# Altium project obc_ver2.PrjPcb (part 1 of 3)
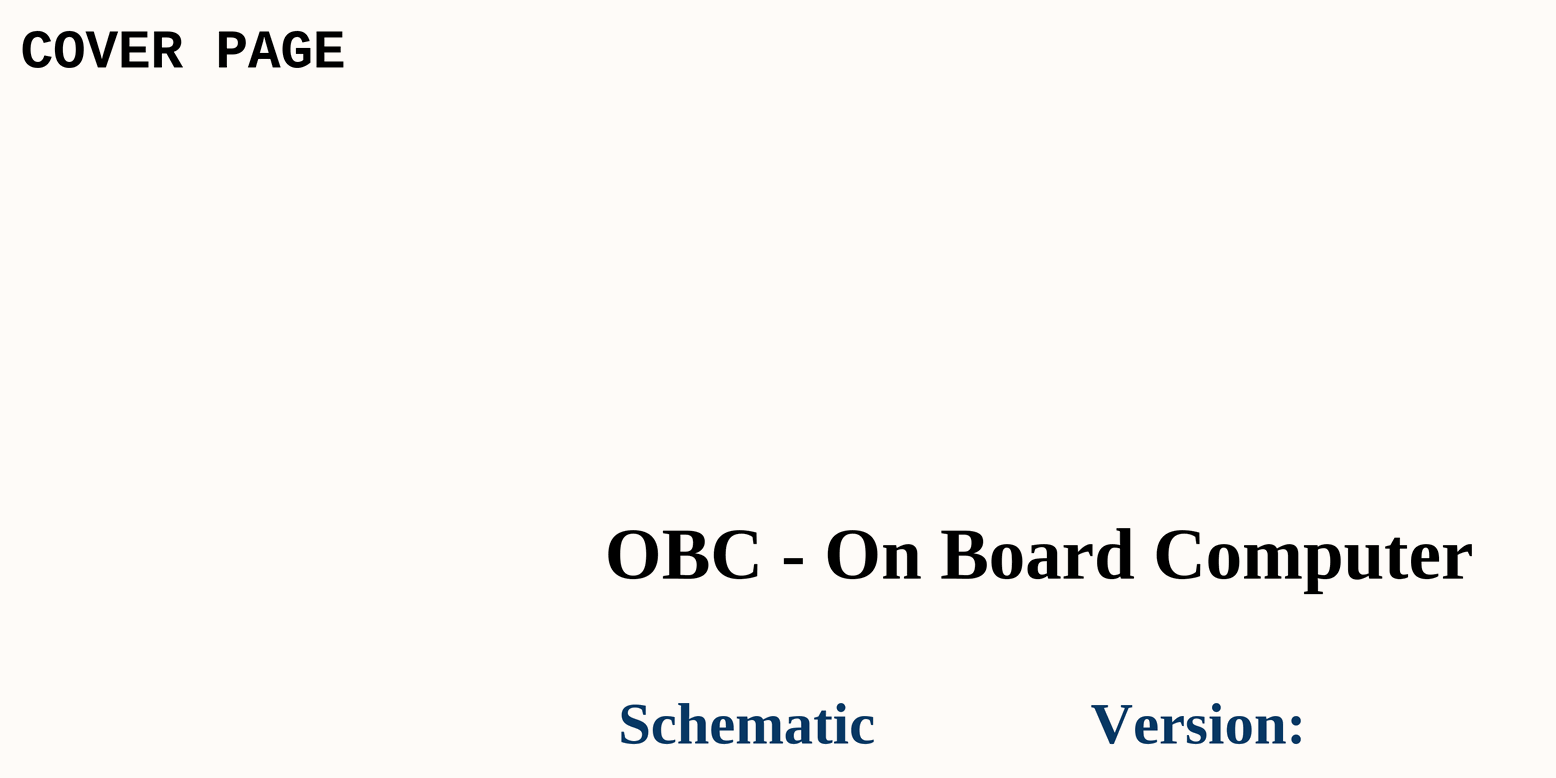
[diagram p0: obc-v2_COVER-PAGE.SchDoc]
23 sheets, 430 parts. Net scope: flat (ports and power ports of the same name join across sheets).
Board file: obc_ver2_pcb.PcbDoc
Sheets:
  obc-v2_COVER-PAGE.SchDoc
  obc-v2_INDEX.SchDoc
  obc-v2_TREE.SchDoc
  obc-v2_POWER.SchDoc
  obc-v2_OUT-eMMC.SchDoc
  obc-v2_TMP-eMMC.SchDoc
  obc-v2_RTC-WDOG.SchDoc
  obc-v2_FRAM-FLASH.SchDoc
  obc-v2_BOARD-CONNECT.SchDoc
  obc-v2_GADGET-CONNECT.SchDoc
  obc-v2_DEBUG.SchDoc
  obc-v2_USB-HUB.SchDoc
  obc-v2_EXP-I2C-IRQ.SchDoc
  obc-v2_EXP-CAN-RS422.SchDoc
  obc-v2_CM4-M2.SchDoc
  obc-v2_CM4-PinOut.SchDoc
  obc-v2_CM4-SPI-UART.SchDoc
  obc-v2_CM4-IRQ-CTRL.SchDoc
  obc-v2_CM4-FUNCTION.SchDoc
  obc-v2_CM4-CSI.SchDoc
  obc-v2_CM4-POWER.SchDoc
  obc-v2_MCU-POWER.SchDoc
  obc-v2_MCU-PinOut.SchDoc

## Sheet obc-v2_COVER-PAGE.SchDoc
size 420 x 297 mm; SheetNumber: 1; SheetTotal: 23

### Notes on the sheet
- COVER PAGE
- OBC - On Board Computer
- Schematic
- Version:
- Project:
- Sub-system:
- Design by:
- Sheet title:
- Sheet
- A3
- of
- Checked by:
- Approved by:
- Revision:
- Document No:
- Size:
- Date:

## Sheet obc-v2_INDEX.SchDoc
size 420 x 297 mm; SheetNumber: 2; SheetTotal: 23
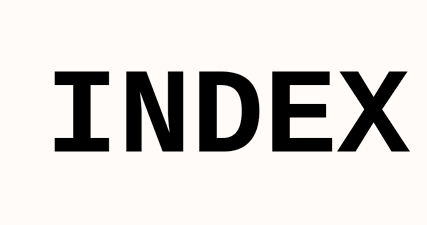
[diagram p1: obc-v2_INDEX.SchDoc]

### Notes on the sheet
- INDEX
- Project:
- Sub-system:
- Design by:
- Sheet title:
- Sheet
- A3
- of
- Checked by:
- Approved by:
- Revision:
- Document No:
- Size:
- Date:

## Sheet obc-v2_TREE.SchDoc
size 420 x 297 mm; SheetNumber: 3; SheetTotal: 23
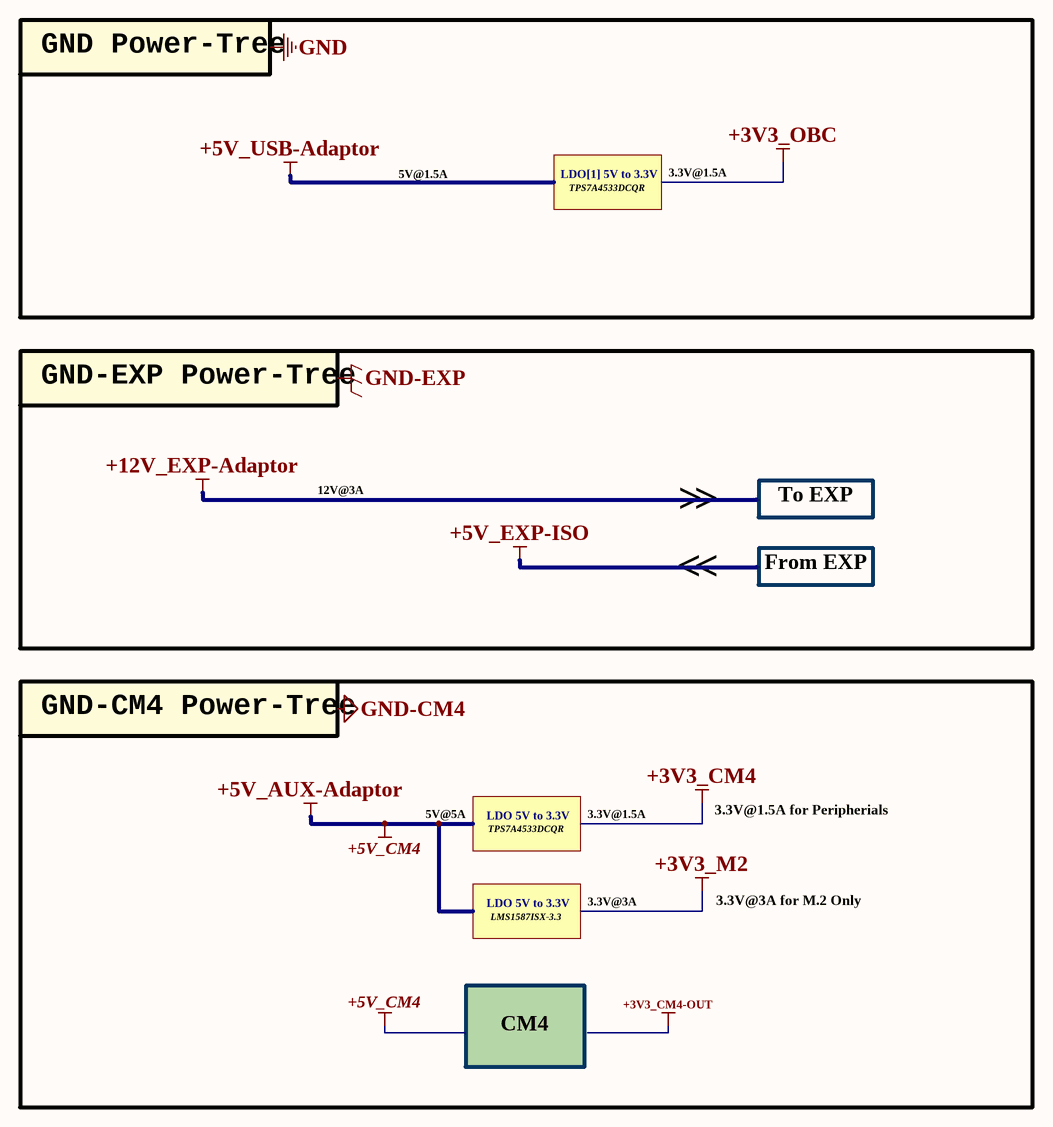
[diagram p2: obc-v2_TREE.SchDoc]

### Notes on the sheet
- GND Power-Tree
- 5V@1.5A
- LDO[1] 5V to 3.3V
- TPS7A4533DCQR
- 3.3V@1.5A
- GND-EXP Power-Tree
- 12V@3A
- >
- To EXP
- <
- From EXP
- GND-CM4 Power-Tree
- 5V@5A
- 3.3V@1.5A for Peripherials
- LDO 5V to 3.3V
- LMS1587ISX-3.3
- 3.3V@3A
- 3.3V@3A for M.2 Only
- CM4
- Labels drawn without touching a wire or pin: GND, GND-CM4, GND-EXP
- Project:
- Sub-system:
- Design by:
- Sheet title:
- Sheet
- A3
- of
- Checked by:
- Approved by:
- Revision:
- Document No:
- Size:
- Date:

## Sheet obc-v2_POWER.SchDoc
size 420 x 297 mm; SheetNumber: 4; SheetTotal: 23
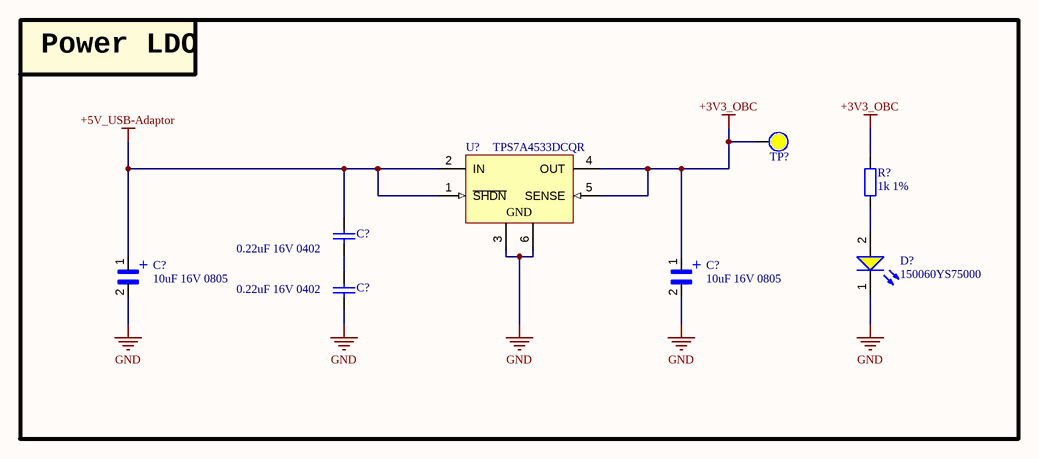
[diagram p3: obc-v2_POWER.SchDoc]

### Parts
(Parts that share a designator on the sheet are numbered #1, #2 ... from top to bottom, then left to right.)
C?#1  0.22uF 16V 0402  [tu 0402]
C?#2  10uF 16V 0805  [CAPC2012X140N]
C?#3  10uF 16V 0805  [CAPC2012X140N]
C?#4  0.22uF 16V 0402  [tu 0402]
D?#1  150060YS75000  [WL-SMCW_0603_150060xx75000]
R?#1  1k 1%  [tro smd 0603]
TP?#1  (no value)  [Test Point 1 Side]  (no BOM)
U?#1  TPS7A4533DCQR  [DCQ0006A_M]

### Blocks framed on the sheet
Power LDO: C?#1-C?#4 D?#1 R?#1 TP?#1 U?#1

### Nets
+3V3_OBC: C?#3.1 R?#1.2 TP?#1.0 U?#1.4(OUT) U?#1.5(SENSE)
+5V_USB-Adaptor: C?#1.1 C?#2.1 U?#1.1(~{SHDN}) U?#1.2(IN)
GND: C?#2.2 C?#3.2 C?#4.2 D?#1.1(K) U?#1.3(GND) U?#1.6(GND)
NetC?#1_2: C?#1.2 C?#4.1
NetD?#1_2: D?#1.2(A) R?#1.1

### Notes on the sheet
- Project:
- Sub-system:
- Design by:
- Sheet title:
- Sheet
- A3
- of
- Checked by:
- Approved by:
- Revision:
- Document No:
- Size:
- Date:
- (in symbol TACR686M003RTA) +

### Library data of the parts
C?#1 C?#4 = Tu 0402 33nF 10V: 0.22 µF ±10% 16V Ceramic Capacitor X7R 0402 (1005 Metric): GCM155R71C224KE02D; Chung_Loai: Dán; Don_Vi: Con; So_Chan: 2; Ten_Linh_Kien: Tụ 0402 33nF X7R 10V GRM155R71A333KA01D; Ma_Hang: MH007853; Kieu_Chan: *
C?#2 C?#3 = TACR686M003RTA: 10 µF Molded Tantalum Capacitors 16 V 0805 (2012 Metric) 8Ohm @ 100kHz: TP8R106M016C; MF: AVX; Availability: Unavailable; SnapEDA_Link: https://www.snapeda.com/parts/TACR686M003RTA/AVX/view-part/1745975/?ref=snap; MP: TACR686M003RTA; Value: *; Price: None; Package: 0805 AVX
D?#1 = CMP-1426-00005-2: LED YELLOW CLEAR 0603 SMD; NexarPartId: 29687085; Wavelength: 590nm; Luminous Intensity: 120mcd; Peak Wavelength: 595nm; Forward Current: 100mA; Power Dissipation: 72mW; Forward Voltage: 2V; Test Current: 20mA; Reverse Voltage: 5V; Lens Style: Clear, Rectangular; Max Junction Temperature (Tj): 95°C; Viewing Angle: 140°; Case Code (Imperial): 0603; Height: 700µm; REACH SVHC: Unknown; Dominant Wavelength: 590nm; Min Operating Temperature: -40°C; Color: Yellow; Width: 800µm; Mount: Surface Mount; Packaging: Tape and Reel; Max Operating Temperature: 85°C; RoHS: Compliant; Max Reverse Voltage (DC): 5V; Case Code (Metric): 1608; Length: 1.6mm; Case/Package: 0603
R?#1 = Tro 0603 1% 10k: RES SMD 2.2K OHM 1% 1/10W 0603, P/N: ERJ-3EKF2201V; Chung_Loai: Dán; Don_Vi: Con; So_Chan: 2; Ten_Linh_Kien: Trở 0603 1% 10k; Ma_Hang: MH006333; Kieu_Chan: *
TP?#1 = Test Point: Solder: NF
U?#1 = CMP-0395-00360-2: Single Output Fast Transient Response LDO, 1.5 A, Fixed 3.3 V Output, 2.1 to 20 V Input, 6-pin SOT-223 (DCQ), -40 to 125 degC, Green (RoHS & no Sb/Br); Manufacturer: Texas Instruments; Vout Adj(Max)(V): 3.3; Vin(Max)(V): 20; Accuracy(%): 1; SubFamily: Single Channel LDO; Vin(Min)(V): 2.1; Iout(Max)(A): 1.5; Vdo(Typ)(mV): 300; Eco-Plan: Green (RoHS & no Sb/Br); Mounting Technology: Surface Mount; PackageDescription: 6-Pin Plastic Small Outline, Body 3.5 x 6.5 mm, Pitch 1.27 mm; ComponentLink2URL: http://www.ti.com/general/docs/lit/getliterature.tsp?genericPartNumber=TPS7A4533&fileType=pdf; PackageReference: DCQ0006A; ComponentLink3Description: Package Specification; ComponentLink2Description: Datasheet; Fixed Output Options(V): 3.3; Iq(Typ)(mA): 1; ComponentLink1URL: http://www.ti.com/; PartNumber: TPS7A4533DCQR; ComponentLink1Description: Manufacturer URL; PackageVersion: 4202109/D; Vout Adj(Min)(V): 3.3; DatasheetVersion: SLVS720D; ComponentLink3URL: http://www.ti.com/litv/pdf/mpds098c

## Sheet obc-v2_OUT-eMMC.SchDoc
size 420 x 297 mm; SheetNumber: 5; SheetTotal: 23
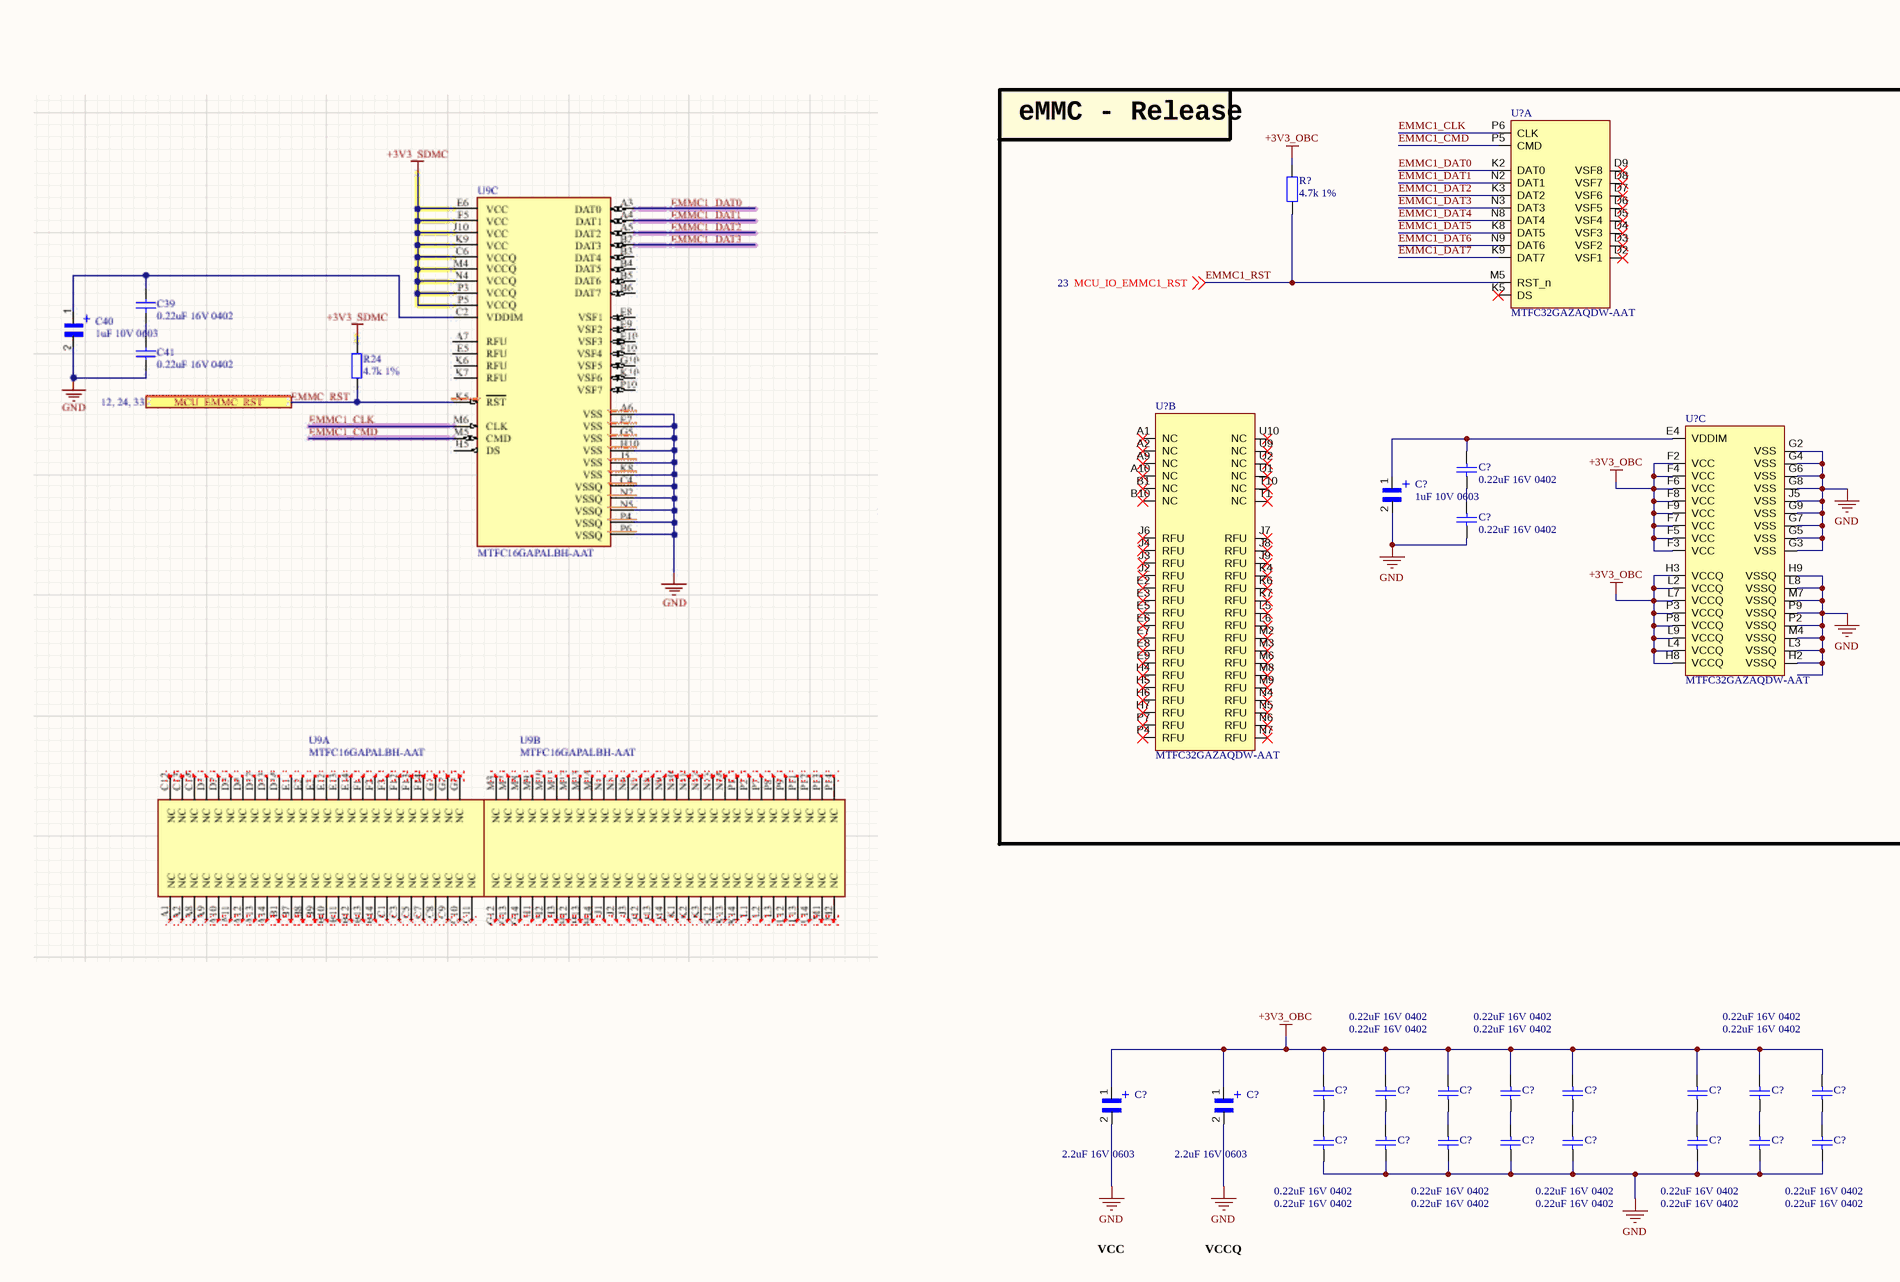
[diagram p4: obc-v2_OUT-eMMC.SchDoc, left]
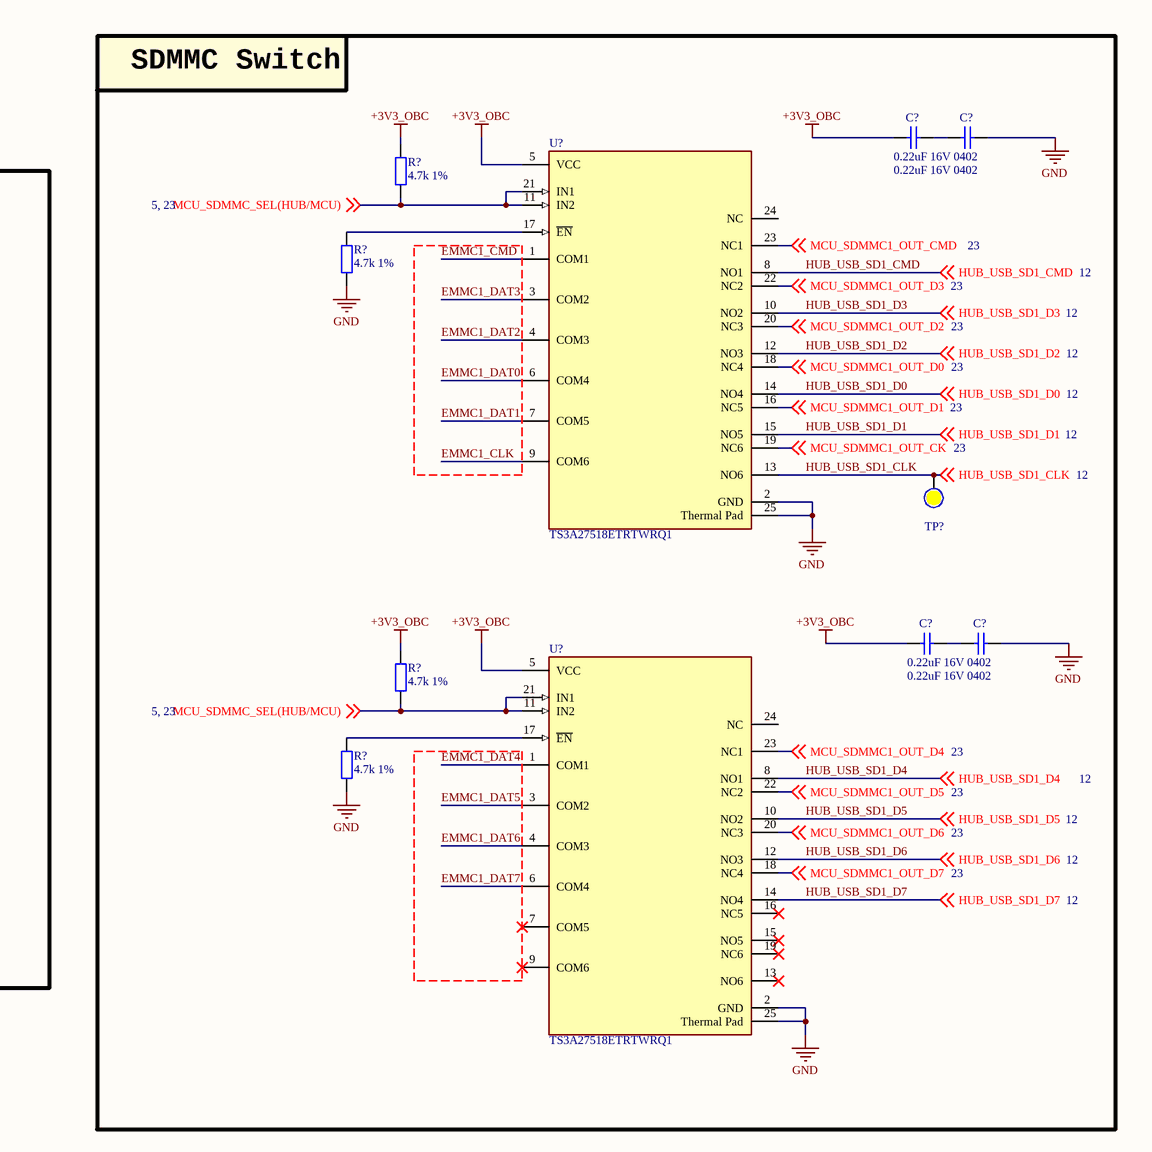
[diagram p5: obc-v2_OUT-eMMC.SchDoc, right]

### Parts
(Parts that share a designator on the sheet are numbered #1, #2 ... from top to bottom, then left to right.)
C?#5  0.22uF 16V 0402  [tu 0402]
C?#6  0.22uF 16V 0402  [tu 0402]
C?#7  0.22uF 16V 0402  [tu 0402]
C?#8  1uF 10V 0603  [CAPC1608X90]
C?#9  0.22uF 16V 0402  [tu 0402]
C?#10  0.22uF 16V 0402  [tu 0402]
C?#11  0.22uF 16V 0402  [tu 0402]
C?#12  0.22uF 16V 0402  [tu 0402]
C?#13  0.22uF 16V 0402  [tu 0402]
C?#14  0.22uF 16V 0402  [tu 0402]
C?#15  0.22uF 16V 0402  [tu 0402]
C?#16  0.22uF 16V 0402  [tu 0402]
C?#17  0.22uF 16V 0402  [tu 0402]
C?#18  0.22uF 16V 0402  [tu 0402]
C?#19  0.22uF 16V 0402  [tu 0402]
C?#20  2.2uF 16V 0603  [CAPC1608X90]
C?#21  2.2uF 16V 0603  [CAPC1608X90]
C?#22  0.22uF 16V 0402  [tu 0402]
C?#23  0.22uF 16V 0402  [tu 0402]
C?#24  0.22uF 16V 0402  [tu 0402]
C?#25  0.22uF 16V 0402  [tu 0402]
C?#26  0.22uF 16V 0402  [tu 0402]
C?#27  0.22uF 16V 0402  [tu 0402]
C?#28  0.22uF 16V 0402  [tu 0402]
C?#29  0.22uF 16V 0402  [tu 0402]
R?#2  4.7k 1%  [tro smd 0603]
R?#3  4.7k 1%  [tro smd 0603]
R?#4  4.7k 1%  [tro smd 0603]
R?#5  4.7k 1%  [tro smd 0603]
R?#6  4.7k 1%  [tro smd 0603]
TP?#2  (no value)  [Test Point 1 Side]  (no BOM)
U?#2  TS3A27518ETRTWRQ1  [FP-RTW0024B-IPC_A]
U?#3  MTFC32GAZAQDW-AAT  (part A of 3)
U?#4  MTFC32GAZAQDW-AAT  (part C of 3)
U?#5  TS3A27518ETRTWRQ1  [FP-RTW0024B-IPC_A]
U?#6  MTFC32GAZAQDW-AAT  (part B of 3)

### Blocks framed on the sheet
SDMMC Switch: C?#5 C?#6 C?#10 C?#11 R?#2 R?#3 R?#5 R?#6 TP?#2 U?#2 U?#5
eMMC - Release: C?#7-C?#9 R?#4 U?#3 U?#4 U?#6

### Nets
+3V3_OBC: C?#5.2 C?#10.2 C?#12.1 C?#13.1 C?#14.1 C?#15.1 C?#16.1 C?#17.1 C?#18.1 C?#19.1 C?#20.1 C?#21.1 R?#2.1 R?#4.1 R?#5.1 U?#2.5(VCC) U?#4.F2(VCC) U?#4.F3(VCC) U?#4.F4(VCC) U?#4.F5(VCC) U?#4.F6(VCC) U?#4.F7(VCC) U?#4.F8(VCC) U?#4.F9(VCC) U?#4.H3(VCCQ) U?#4.H8(VCCQ) U?#4.L2(VCCQ) U?#4.L4(VCCQ) U?#4.L7(VCCQ) U?#4.L9(VCCQ) U?#4.P3(VCCQ) U?#4.P8(VCCQ) U?#5.5(VCC)
GND: C?#6.1 C?#8.2 C?#9.2 C?#11.1 C?#20.2 C?#21.2 C?#22.2 C?#23.2 C?#24.2 C?#25.2 C?#26.2 C?#27.2 C?#28.2 C?#29.2 R?#3.2 R?#6.2 U?#2.2(GND) U?#2.25(Thermal_Pad) U?#4.G2(VSS) U?#4.G3(VSS) U?#4.G4(VSS) U?#4.G5(VSS) U?#4.G6(VSS) U?#4.G7(VSS) U?#4.G8(VSS) U?#4.G9(VSS) U?#4.H2(VSSQ) U?#4.H9(VSSQ) U?#4.J5(VSS) U?#4.L3(VSSQ) U?#4.L8(VSSQ) U?#4.M4(VSSQ) U?#4.M7(VSSQ) U?#4.P2(VSSQ) U?#4.P9(VSSQ) U?#5.2(GND) U?#5.25(Thermal_Pad)
EMMC1_CLK: U?#2.9(COM6) U?#3.P6(CLK)
EMMC1_CMD: U?#2.1(COM1) U?#3.P5(CMD)
EMMC1_DAT0: U?#2.6(COM4) U?#3.K2(DAT0)
EMMC1_DAT1: U?#2.7(COM5) U?#3.N2(DAT1)
EMMC1_DAT2: U?#2.4(COM3) U?#3.K3(DAT2)
EMMC1_DAT3: U?#2.3(COM2) U?#3.N3(DAT3)
EMMC1_DAT4: U?#3.N8(DAT4) U?#5.1(COM1)
EMMC1_DAT5: U?#3.K8(DAT5) U?#5.3(COM2)
EMMC1_DAT6: U?#3.N9(DAT6) U?#5.4(COM3)
EMMC1_DAT7: U?#3.K9(DAT7) U?#5.6(COM4)
EMMC1_RST: R?#4.2 U?#3.M5(RST_n) ; off-sheet MCU_IO_EMMC1_RST  [also labelled MCU_IO_EMMC1_RST]
HUB_USB_SD1_CLK: TP?#2.0 U?#2.13(NO6) ; off-sheet HUB_USB_SD1_CLK  [project net HUB_SDMMC1_CLK]
HUB_USB_SD1_CMD: U?#2.8(NO1) ; off-sheet HUB_USB_SD1_CMD  [project net HUB_SDMMC1_CMD]
HUB_USB_SD1_D0: U?#2.14(NO4) ; off-sheet HUB_USB_SD1_D0  [project net HUB_SDMMC1_D0]
HUB_USB_SD1_D1: U?#2.15(NO5) ; off-sheet HUB_USB_SD1_D1  [project net HUB_SDMMC1_D1]
HUB_USB_SD1_D2: U?#2.12(NO3) ; off-sheet HUB_USB_SD1_D2  [project net HUB_SDMMC1_D2]
HUB_USB_SD1_D3: U?#2.10(NO2) ; off-sheet HUB_USB_SD1_D3  [project net HUB_SDMMC1_D3]
HUB_USB_SD1_D4: U?#5.8(NO1) ; off-sheet HUB_USB_SD1_D4  [project net HUB_SDMMC1_D4]
HUB_USB_SD1_D5: U?#5.10(NO2) ; off-sheet HUB_USB_SD1_D5  [project net HUB_SDMMC1_D5]
HUB_USB_SD1_D6: U?#5.12(NO3) ; off-sheet HUB_USB_SD1_D6  [project net HUB_SDMMC1_D6]
HUB_USB_SD1_D7: U?#5.14(NO4) ; off-sheet HUB_USB_SD1_D7  [project net HUB_SDMMC1_D7]
MCU_SDMMC1_OUT_CK: U?#2.19(NC6) ; off-sheet MCU_SDMMC1_OUT_CK
MCU_SDMMC1_OUT_CMD: U?#2.23(NC1) ; off-sheet MCU_SDMMC1_OUT_CMD
MCU_SDMMC1_OUT_D0: U?#2.18(NC4) ; off-sheet MCU_SDMMC1_OUT_D0
MCU_SDMMC1_OUT_D1: U?#2.16(NC5) ; off-sheet MCU_SDMMC1_OUT_D1
MCU_SDMMC1_OUT_D2: U?#2.20(NC3) ; off-sheet MCU_SDMMC1_OUT_D2
MCU_SDMMC1_OUT_D3: U?#2.22(NC2) ; off-sheet MCU_SDMMC1_OUT_D3
MCU_SDMMC1_OUT_D4: U?#5.23(NC1) ; off-sheet MCU_SDMMC1_OUT_D4
MCU_SDMMC1_OUT_D5: U?#5.22(NC2) ; off-sheet MCU_SDMMC1_OUT_D5
MCU_SDMMC1_OUT_D6: U?#5.20(NC3) ; off-sheet MCU_SDMMC1_OUT_D6
MCU_SDMMC1_OUT_D7: U?#5.18(NC4) ; off-sheet MCU_SDMMC1_OUT_D7
MCU_SDMMC_SEL(HUB/MCU): R?#2.2 R?#5.2 U?#2.11(IN2) U?#2.21(IN1) U?#5.11(IN2) U?#5.21(IN1) ; off-sheet MCU_SDMMC_SEL(HUB/MCU)
NetC?#5_1: C?#5.1 C?#6.2
NetC?#7_1: C?#7.1 C?#8.1 U?#4.E4(VDDIM)
NetC?#7_2: C?#7.2 C?#9.1
NetC?#10_1: C?#10.1 C?#11.2
NetC?#12_2: C?#12.2 C?#22.1
NetC?#13_2: C?#13.2 C?#23.1
NetC?#14_2: C?#14.2 C?#24.1
NetC?#15_2: C?#15.2 C?#25.1
NetC?#16_2: C?#16.2 C?#26.1
NetC?#17_2: C?#17.2 C?#27.1
NetC?#18_2: C?#18.2 C?#28.1
NetC?#19_2: C?#19.2 C?#29.1
NetR?#3_1: R?#3.1 U?#2.17(~{EN})
NetR?#6_1: R?#6.1 U?#5.17(~{EN})

Not connected (* = marked no-connect by the designer): U?#2 24(NC); U?#3 D2(VSF1)* D3(VSF2)* D4(VSF3)* D5(VSF4)* D6(VSF5)* D7(VSF6)* D8(VSF7)* D9(VSF8)* K5(DS)*; U?#5 7(COM5)* 9(COM6)* 13(NO6)* 15(NO5)* 16(NC5)* 19(NC6)* 24(NC); U?#6 A1(NC)* A2(NC)* A9(NC)* A10(NC)* B1(NC)* B10(NC)* E2(RFU)* E3(RFU)* E5(RFU)* E6(RFU)* E7(RFU)* E8(RFU)* E9(RFU)* H4(RFU)* H5(RFU)* H6(RFU)* H7(RFU)* J2(RFU)* J3(RFU)* J4(RFU)* J6(RFU)* J7(RFU)* J8(RFU)* J9(RFU)* K4(RFU)* K6(RFU)* K7(RFU)* L5(RFU)* L6(RFU)* M2(RFU)* M3(RFU)* M6(RFU)* M8(RFU)* M9(RFU)* N4(RFU)* N5(RFU)* N6(RFU)* N7(RFU)* P4(RFU)* P7(RFU)* T1(NC)* T10(NC)* U1(NC)* U2(NC)* U9(NC)* U10(NC)*

### Notes on the sheet
- VCC
- VCCQ
- Project:
- Sub-system:
- Design by:
- Sheet title:
- Sheet
- A3
- of
- Checked by:
- Approved by:
- Revision:
- Document No:
- Size:
- Date:
- (in symbol TACL335M003RTA) +

### Library data of the parts
C?#5-C?#7 C?#9-C?#19 C?#22-C?#29 = Tu 0402 33nF 10V: as C?#1 on sheet obc-v2_POWER; Kieu_Chan: *
C?#8 = TACL335M003RTA: 1 µF Molded Tantalum Capacitors 10 V 0603 (1608 Metric) 12Ohm @ 100kHz: TP8M105M010C; Package: None; Price: None; Value: *; MP: TACL335M003RTA; Availability: Unavailable
C?#20 C?#21 = TACL335M003RTA: 2.2 µF Molded Tantalum Capacitors 16 V 0603 (1608 Metric) 12Ohm @ 100kHz: TP8M225M016C; Package: None; Price: None; Value: *; MP: TACL335M003RTA; Availability: Unavailable
R?#2-R?#6 = Tro 0603 1% 10k: RES 4.7K OHM 1% 1/10W 0603, P/N: ERJ-U03F4701V; Chung_Loai: Dán; Don_Vi: Con; So_Chan: 2; Ten_Linh_Kien: Trở 0603 1% 10k; Ma_Hang: MH006333; Kieu_Chan: *
TP?#2 = Test Point: Solder: NF
U?#2 U?#5 = CMP-04892-000110-1: IC MUX/DEMUX 1X2 24WQFN; Supply Type: Single; Max Supply Voltage: 3.6V; Number of Circuits: 6; On-State Resistance: 6.2R; Turn-Off Delay Time: 70ns; -3db Bandwidth: 240MHz; Operating Supply Current: 40nA; Min Supply Voltage: 1.65V; Logic Function: Multiplexer; Turn-On Delay Time: 68ns; Min Operating Temperature: -40°C; Packaging: Tape and Reel; Case/Package: QFN; Package Quantity: 1; RoHS Compliant: Yes; Lead Free: Lead Free; Bandwidth: 240MHz; Max Operating Temperature: 105°C; Number of Channels: 6; Series: Automotive, AEC-Q100; Number of Pins: 24; Mount: Surface Mount

## Sheet obc-v2_TMP-eMMC.SchDoc
size 420 x 297 mm; SheetNumber: 6; SheetTotal: 23
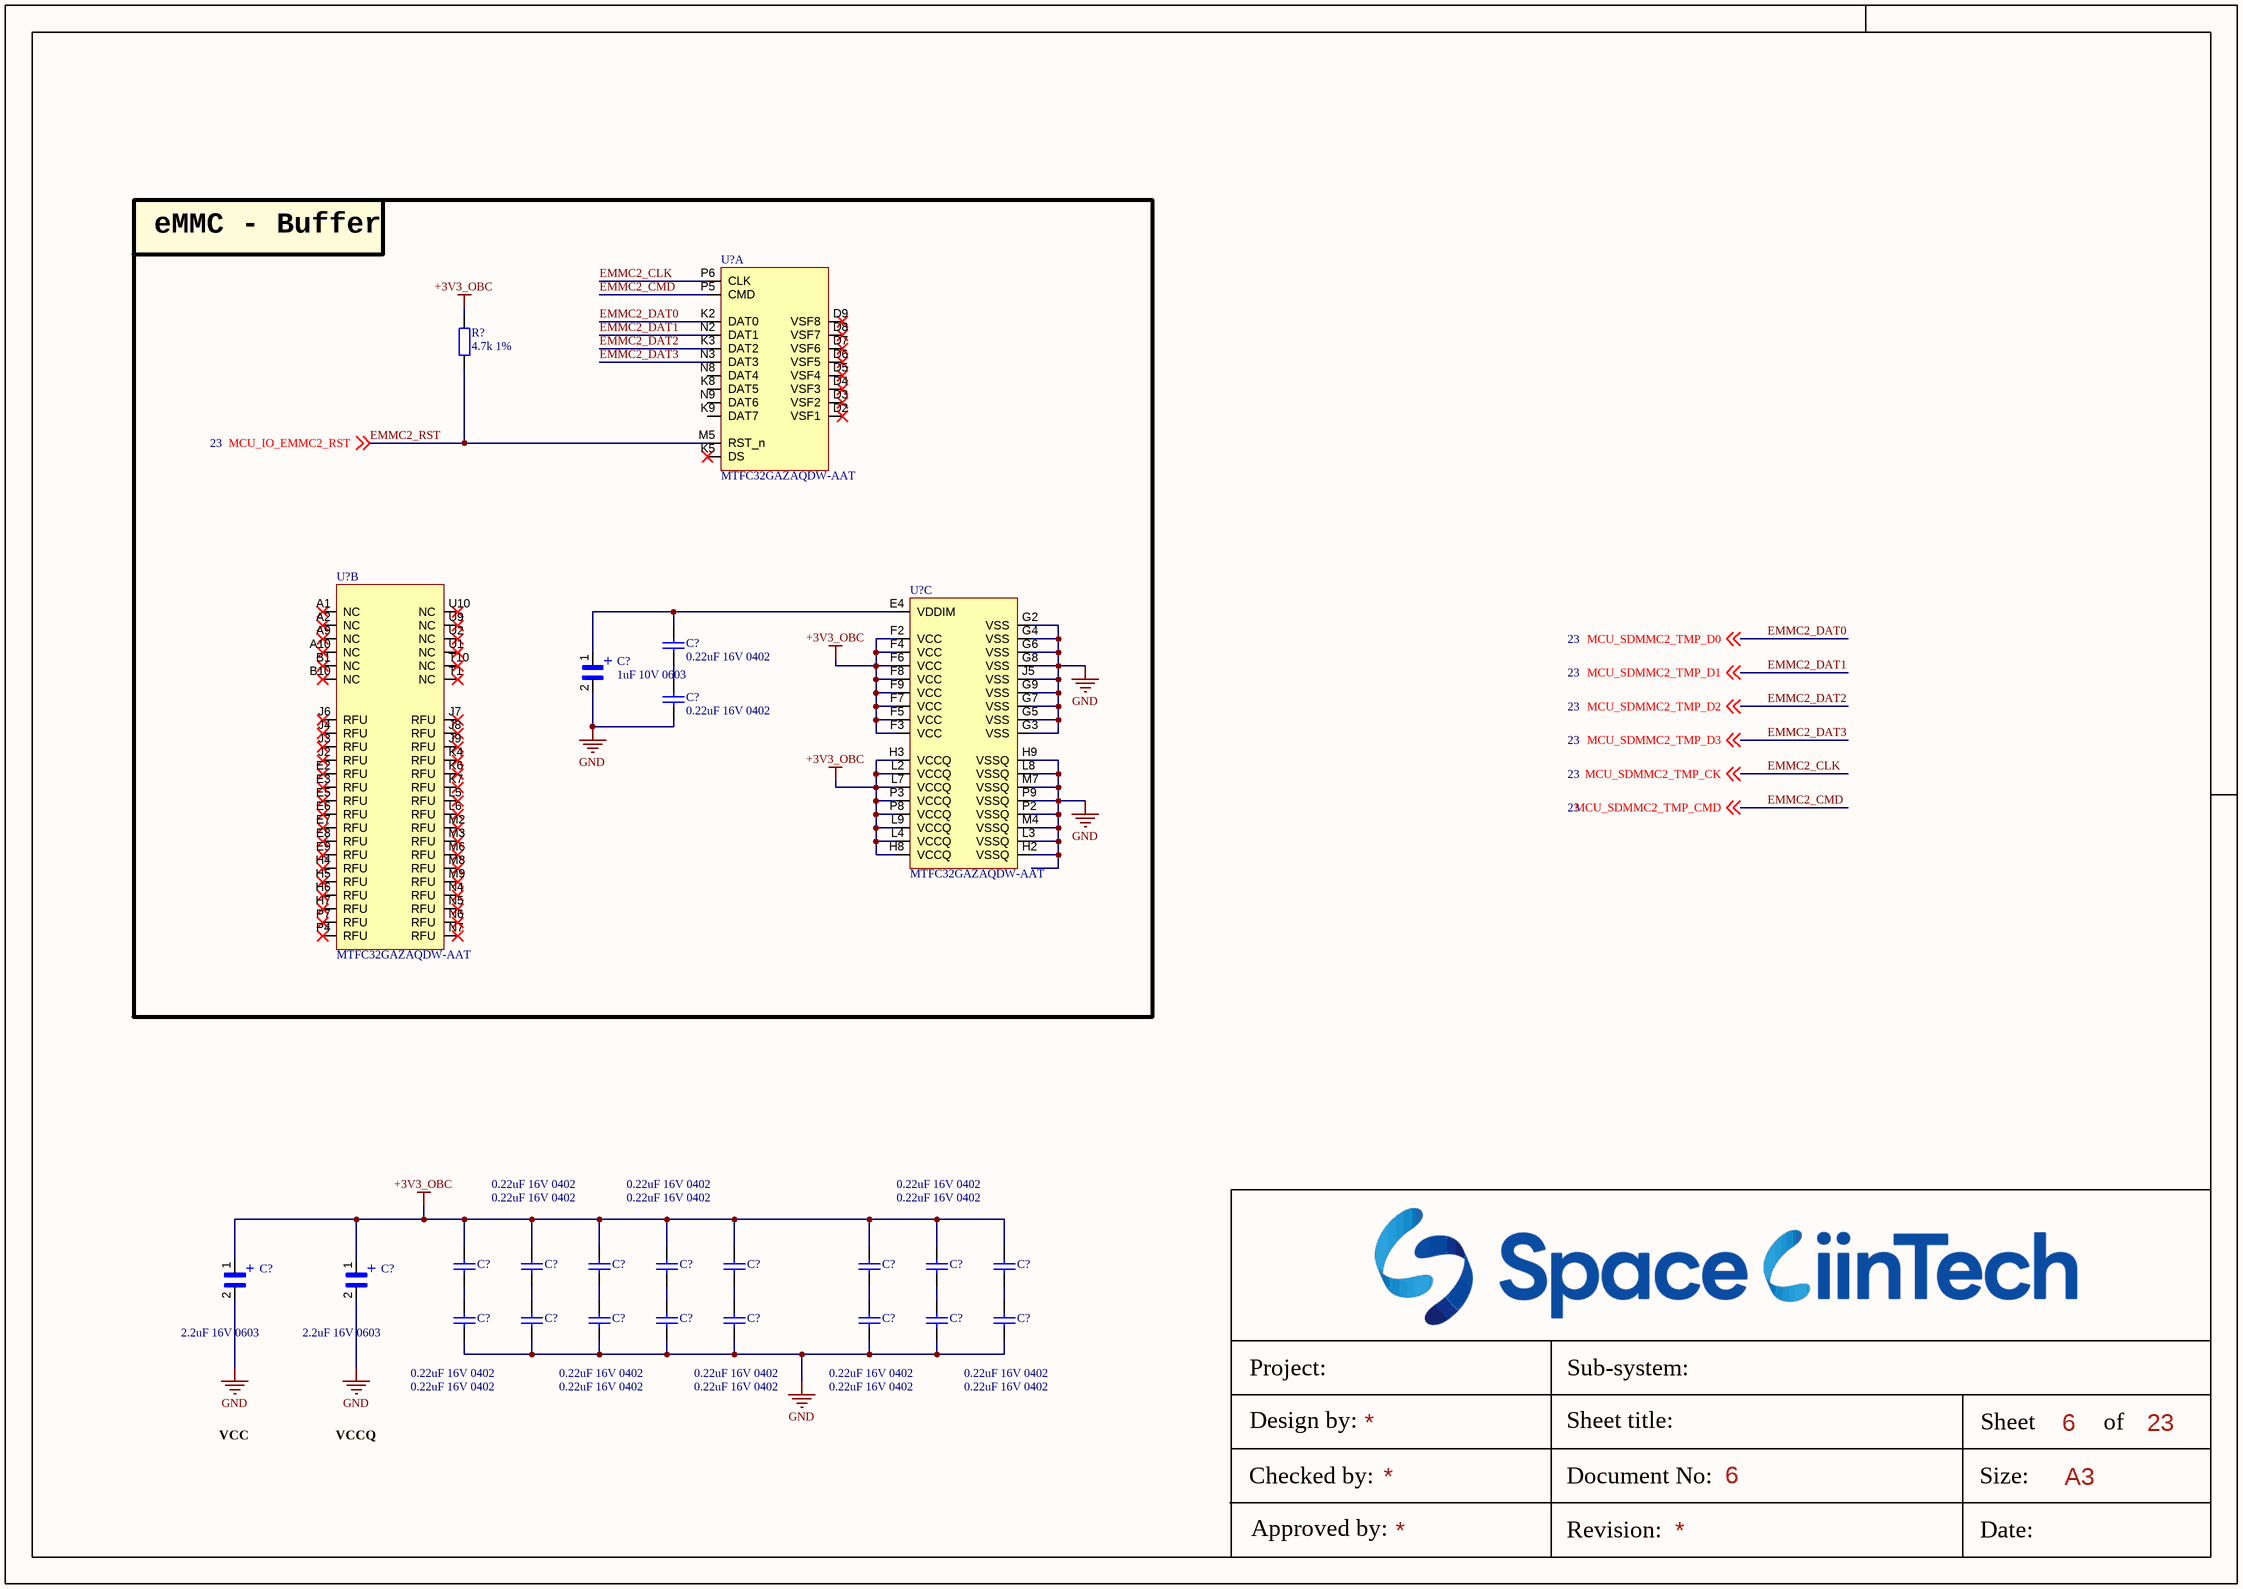
[diagram p6: obc-v2_TMP-eMMC.SchDoc]

### Parts
(Parts that share a designator on the sheet are numbered #1, #2 ... from top to bottom, then left to right.)
C?#30  0.22uF 16V 0402  [tu 0402]
C?#31  1uF 10V 0603  [CAPC1608X90]
C?#32  0.22uF 16V 0402  [tu 0402]
C?#33  0.22uF 16V 0402  [tu 0402]
C?#34  0.22uF 16V 0402  [tu 0402]
C?#35  0.22uF 16V 0402  [tu 0402]
C?#36  0.22uF 16V 0402  [tu 0402]
C?#37  0.22uF 16V 0402  [tu 0402]
C?#38  0.22uF 16V 0402  [tu 0402]
C?#39  0.22uF 16V 0402  [tu 0402]
C?#40  0.22uF 16V 0402  [tu 0402]
C?#41  2.2uF 16V 0603  [CAPC1608X90]
C?#42  2.2uF 16V 0603  [CAPC1608X90]
C?#43  0.22uF 16V 0402  [tu 0402]
C?#44  0.22uF 16V 0402  [tu 0402]
C?#45  0.22uF 16V 0402  [tu 0402]
C?#46  0.22uF 16V 0402  [tu 0402]
C?#47  0.22uF 16V 0402  [tu 0402]
C?#48  0.22uF 16V 0402  [tu 0402]
C?#49  0.22uF 16V 0402  [tu 0402]
C?#50  0.22uF 16V 0402  [tu 0402]
R?#7  4.7k 1%  [tro smd 0603]
U?#7  MTFC32GAZAQDW-AAT  (part A of 3)
U?#8  MTFC32GAZAQDW-AAT  (part C of 3)
U?#9  MTFC32GAZAQDW-AAT  (part B of 3)

### Blocks framed on the sheet
eMMC - Buffer: C?#30-C?#32 R?#7 U?#7-U?#9

### Nets
+3V3_OBC: C?#33.1 C?#34.1 C?#35.1 C?#36.1 C?#37.1 C?#38.1 C?#39.1 C?#40.1 C?#41.1 C?#42.1 R?#7.1 U?#8.F2(VCC) U?#8.F3(VCC) U?#8.F4(VCC) U?#8.F5(VCC) U?#8.F6(VCC) U?#8.F7(VCC) U?#8.F8(VCC) U?#8.F9(VCC) U?#8.H3(VCCQ) U?#8.H8(VCCQ) U?#8.L2(VCCQ) U?#8.L4(VCCQ) U?#8.L7(VCCQ) U?#8.L9(VCCQ) U?#8.P3(VCCQ) U?#8.P8(VCCQ)
GND: C?#31.2 C?#32.2 C?#41.2 C?#42.2 C?#43.2 C?#44.2 C?#45.2 C?#46.2 C?#47.2 C?#48.2 C?#49.2 C?#50.2 U?#8.G2(VSS) U?#8.G3(VSS) U?#8.G4(VSS) U?#8.G5(VSS) U?#8.G6(VSS) U?#8.G7(VSS) U?#8.G8(VSS) U?#8.G9(VSS) U?#8.H2(VSSQ) U?#8.H9(VSSQ) U?#8.J5(VSS) U?#8.L3(VSSQ) U?#8.L8(VSSQ) U?#8.M4(VSSQ) U?#8.M7(VSSQ) U?#8.P2(VSSQ) U?#8.P9(VSSQ)
EMMC2_CLK: U?#7.P6(CLK) ; off-sheet MCU_SDMMC2_TMP_CK  [also labelled MCU_SDMMC2_TMP_CK]
EMMC2_CMD: U?#7.P5(CMD) ; off-sheet MCU_SDMMC2_TMP_CMD  [also labelled MCU_SDMMC2_TMP_CMD]
EMMC2_DAT0: U?#7.K2(DAT0) ; off-sheet MCU_SDMMC2_TMP_D0  [also labelled MCU_SDMMC2_TMP_D0]
EMMC2_DAT1: U?#7.N2(DAT1) ; off-sheet MCU_SDMMC2_TMP_D1  [also labelled MCU_SDMMC2_TMP_D1]
EMMC2_DAT2: U?#7.K3(DAT2) ; off-sheet MCU_SDMMC2_TMP_D2  [also labelled MCU_SDMMC2_TMP_D2]
EMMC2_DAT3: U?#7.N3(DAT3) ; off-sheet MCU_SDMMC2_TMP_D3  [also labelled MCU_SDMMC2_TMP_D3]
EMMC2_RST: R?#7.2 U?#7.M5(RST_n) ; off-sheet MCU_IO_EMMC2_RST  [also labelled MCU_IO_EMMC2_RST]
NetC?#30_1: C?#30.1 C?#31.1 U?#8.E4(VDDIM)
NetC?#30_2: C?#30.2 C?#32.1
NetC?#33_2: C?#33.2 C?#43.1
NetC?#34_2: C?#34.2 C?#44.1
NetC?#35_2: C?#35.2 C?#45.1
NetC?#36_2: C?#36.2 C?#46.1
NetC?#37_2: C?#37.2 C?#47.1
NetC?#38_2: C?#38.2 C?#48.1
NetC?#39_2: C?#39.2 C?#49.1
NetC?#40_2: C?#40.2 C?#50.1

Not connected (* = marked no-connect by the designer): U?#7 D2(VSF1)* D3(VSF2)* D4(VSF3)* D5(VSF4)* D6(VSF5)* D7(VSF6)* D8(VSF7)* D9(VSF8)* K5(DS)* K8(DAT5) K9(DAT7) N8(DAT4) N9(DAT6); U?#9 A1(NC)* A2(NC)* A9(NC)* A10(NC)* B1(NC)* B10(NC)* E2(RFU)* E3(RFU)* E5(RFU)* E6(RFU)* E7(RFU)* E8(RFU)* E9(RFU)* H4(RFU)* H5(RFU)* H6(RFU)* H7(RFU)* J2(RFU)* J3(RFU)* J4(RFU)* J6(RFU)* J7(RFU)* J8(RFU)* J9(RFU)* K4(RFU)* K6(RFU)* K7(RFU)* L5(RFU)* L6(RFU)* M2(RFU)* M3(RFU)* M6(RFU)* M8(RFU)* M9(RFU)* N4(RFU)* N5(RFU)* N6(RFU)* N7(RFU)* P4(RFU)* P7(RFU)* T1(NC)* T10(NC)* U1(NC)* U2(NC)* U9(NC)* U10(NC)*

### Notes on the sheet
- VCC
- VCCQ
- Project:
- Sub-system:
- Design by:
- Sheet title:
- Sheet
- A3
- of
- Checked by:
- Approved by:
- Revision:
- Document No:
- Size:
- Date:
- (in symbol TACL335M003RTA) +

### Library data of the parts
C?#30 C?#32-C?#40 C?#43-C?#50 = Tu 0402 33nF 10V: as C?#1 on sheet obc-v2_POWER; Kieu_Chan: *
C?#31 = TACL335M003RTA: as C?#8 on sheet obc-v2_OUT-eMMC; Package: None; Price: None; Value: *; MP: TACL335M003RTA; Availability: Unavailable
C?#41 C?#42 = TACL335M003RTA: as C?#20 on sheet obc-v2_OUT-eMMC; Package: None; Price: None; Value: *; MP: TACL335M003RTA; Availability: Unavailable
R?#7 = Tro 0603 1% 10k: as R?#2 on sheet obc-v2_OUT-eMMC; Kieu_Chan: *

## Sheet obc-v2_RTC-WDOG.SchDoc
size 420 x 297 mm; SheetNumber: 7; SheetTotal: 23
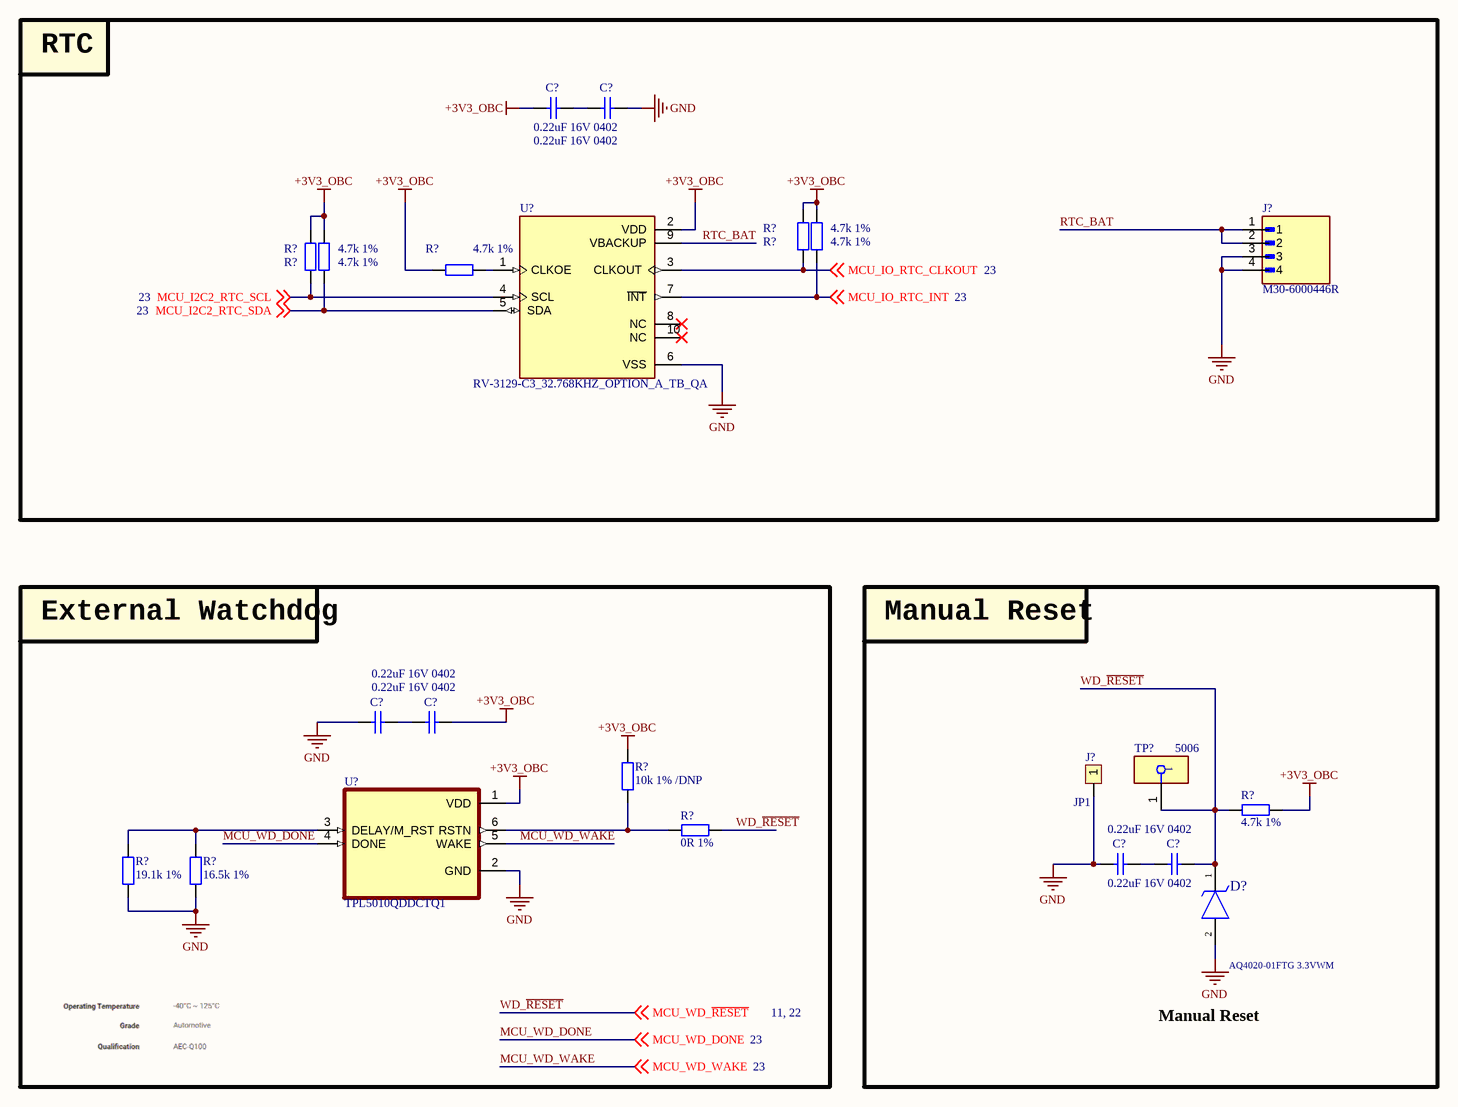
[diagram p7: obc-v2_RTC-WDOG.SchDoc]

### Parts
(Parts that share a designator on the sheet are numbered #1, #2 ... from top to bottom, then left to right.)
C?#51  0.22uF 16V 0402  [tu 0402]
C?#52  0.22uF 16V 0402  [tu 0402]
C?#53  0.22uF 16V 0402  [tu 0402]
C?#54  0.22uF 16V 0402  [tu 0402]
C?#55  0.22uF 16V 0402  [tu 0402]
C?#56  0.22uF 16V 0402  [tu 0402]
D?#2  3.3VWM: AQ4020-01FTG 3.3VWM  [SOD2613X114N]  (hidden comment: AQ4020-01FTG)
J?#1  M30-6000446R  [HARWIN_M30-6000446R]
J?#2  JP1  [JP1-D1T]
R?#8  4.7k 1%  [tro smd 0603]
R?#9  4.7k 1%  [tro smd 0603]
R?#10  4.7k 1%  [tro smd 0603]
R?#11  4.7k 1%  [tro smd 0603]
R?#12  4.7k 1%  [tro smd 0603]
R?#13  10k 1% /DNP  [tro smd 0603]
R?#14  4.7k 1%  [tro smd 0603]
R?#15  0R 1%  [tro smd 0603]
R?#16  19.1k 1%  [tro smd 0603]
R?#17  16.5k 1%  [tro smd 0603]
TP?#3  5006  [FP-5006-MFG]
U?#10  RV-3129-C3_32.768KHZ_OPTION_A_TB_QA  [IC_RV-3129-C3_32.768KHZ_OPTION_A_TB_QA]
U?#11  TPL5010QDDCTQ1  [SOT95P280X110-6N]

### Blocks framed on the sheet
RTC: C?#51 C?#52 J?#1 R?#8-R?#12 U?#10
External Watchdog: C?#53 C?#54 R?#13 R?#15-R?#17 U?#11
Manual Reset: C?#55 C?#56 D?#2 J?#2 R?#14 TP?#3

### Nets
+3V3_OBC: C?#51.2 C?#54.1 R?#8.2 R?#9.2 R?#10.2 R?#11.2 R?#12.2 R?#13.2 R?#14.2 U?#10.2(VDD) U?#11.1(VDD)
GND: C?#52.1 C?#53.2 C?#55.2 D?#2.2 J?#1.3 J?#1.4 J?#2.1 R?#16.1 R?#17.1 U?#10.6(VSS) U?#11.2(GND)
MCU_I2C2_RTC_SCL: R?#10.1 U?#10.4(SCL) ; off-sheet MCU_I2C2_RTC_SCL
MCU_I2C2_RTC_SDA: R?#11.1 U?#10.5(SDA) ; off-sheet MCU_I2C2_RTC_SDA
MCU_IO_RTC_CLKOUT: R?#8.1 U?#10.3(CLKOUT) ; off-sheet MCU_IO_RTC_CLKOUT
MCU_IO_RTC_INT: R?#9.1 U?#10.7(~{INT}) ; off-sheet MCU_IO_RTC_INT
MCU_WD_DONE: U?#11.4(DONE) ; off-sheet MCU_WD_DONE
MCU_WD_~{RESET}: C?#56.1 D?#2.1 R?#14.1 R?#15.1 TP?#3.1 ; off-sheet MCU_WD_~{RESET}  [also labelled WD_~{RESET}]  [project net MCU_~{RST}]
MCU_WD_WAKE: U?#11.5(WAKE) ; off-sheet MCU_WD_WAKE
RTC_BAT: J?#1.1 J?#1.2 U?#10.9(VBACKUP)
NetC?#51_1: C?#51.1 C?#52.2
NetC?#53_1: C?#53.1 C?#54.2
NetC?#55_1: C?#55.1 C?#56.2
NetR?#12_1: R?#12.1 U?#10.1(CLKOE)
NetR?#13_1: R?#13.1 R?#15.2 U?#11.6(RSTN)
NetR?#16_2: R?#16.2 R?#17.2 U?#11.3(DELAY/M_RST)

Not connected (* = marked no-connect by the designer): U?#10 8(NC)* 10(NC)*

### Notes on the sheet
- Manual Reset
- Project:
- Sub-system:
- Design by:
- Sheet title:
- Sheet
- A3
- of
- Checked by:
- Approved by:
- Revision:
- Document No:
- Size:
- Date:

### Library data of the parts
C?#51-C?#56 = Tu 0402 33nF 10V: as C?#1 on sheet obc-v2_POWER; Kieu_Chan: *
D?#2 = AQ4020-01FTG: ESD Suppressors / TVS Diodes 30A 2.5pF AEC-Q101; Manufacturer_Name: LITTELFUSE; Supplier: https://componentsearchengine.com/Datasheets/2/AQ4020-01FTG.pdf; Description_: ESD Suppressors / TVS Diodes 30A 2.5pF AEC-Q101; Height: 1.14; Mouser Part Number: 576-AQ4020-01FTG; Mouser Price/Stock: https://www.mouser.co.uk/ProductDetail/Littelfuse/AQ4020-01FTG?qs=YCa%2FAAYMW015W3B84qpvIw%3D%3D; Manufacturer_Part_Number: AQ4020-01FTG
J?#2 = JP1: WR-PHD 2.54 mm Angled Socket Header; Manufacturer: W¨¹rth Elektronik eiSos GmbH; partNo: 613002143121; ComponentLink1 Description: Manufacturer; ComponentLink2 Description: Datasheet; NoPins: 02; Created Date: 29 March 2013; ComponentLink1URL: http://www.we-online.com; ComponentLink2URL: http://katalog.we-online.de/em/datasheet/6130xx143121.pdf; Created by: Karrer Zheng
R?#8-R?#12 R?#14 = Tro 0603 1% 10k: as R?#2 on sheet obc-v2_OUT-eMMC; Kieu_Chan: *
R?#13 = Tro 0603 1% 10k: RES SMD 10K OHM 1% 1/10W 0603, P/N: ERJ-3EKF1002V; Chung_Loai: Dán; Don_Vi: Con; So_Chan: 2; Ten_Linh_Kien: Trở 0603 1% 10k; Ma_Hang: MH006333; Kieu_Chan: *
R?#15 = Tro 0603 1% 10k: RES SMD 0 OHM JUMPER 1/10W 0603, P/N: ERJ-3GEY0R00V; Chung_Loai: Dán; Don_Vi: Con; So_Chan: 2; Ten_Linh_Kien: Trở 0603 1% 10k; Ma_Hang: MH006333; Kieu_Chan: *
R?#16 = Tro 0603 1% 10k: RES SMD 19.1K OHM 1% 1/10W 0603, P/N: ERJ-3EKF1912V; Chung_Loai: Dán; Don_Vi: Con; So_Chan: 2; Ten_Linh_Kien: Trở 0603 1% 10k; Ma_Hang: MH006333; Kieu_Chan: *
R?#17 = Tro 0603 1% 10k: RES SMD 16.5K OHM 1% 1/10W 0603, P/N: ERJ-3EKF1652V; Chung_Loai: Dán; Don_Vi: Con; So_Chan: 2; Ten_Linh_Kien: Trở 0603 1% 10k; Ma_Hang: MH006333; Kieu_Chan: *
TP?#3 = CMP-19636-000022-1: PC TEST POINT COMPACT BLACK; Body Material: Bronze; Inside Diameter: 1.78mm; Number of Ports: 1; Hole Diameter: 1.6mm; Outside Diameter: 3.18mm; Plating: Silver; Contact Plating: Tin; Color: Black; RoHS Compliant: Yes; Flammability Rating: UL94 V-0; Contact Material: Bronze; Material: Nylon; Orientation: Straight; Package Quantity: 100; Housing Color: Black; Length: 8.89mm; Series: THM; Mount: PCB; Height: 0.35inch; Packaging: Bulk; REACH SVHC: No SVHC; Insulation Material: Nylon; Lead Free: Lead Free
U?#10 = RV-3129-C3_32.768KHZ_OPTION_A_TB_QA: Real-Time Clock Module, Temperature compensated, in 2.5 x 3.7 mm package; MF: Micro Crystal; MP: RV-3129-C3 32.768KHZ OPTION A TB QA; SnapEDA_Link: https://www.snapeda.com/parts/RV-3129-C3%2032.768KHZ%20OPTION%20A%20TB%20QA/Micro+Crystal/view-part/?ref=snap; Package: QFN-10 Micro Crystal; Value: *; Check_prices: https://www.snapeda.com/parts/RV-3129-C3%2032.768KHZ%20OPTION%20A%20TB%20QA/Micro+Crystal/view-part/?ref=eda
J?#1 = M30-6000446R: Package: None; Price: None; Value: *; MP: M30-6000446R; Availability: Unavailable
U?#11 = TPL5010QDDCTQ1: Package: None; Price: None; Value: *; MP: TPL5010QDDCTQ1; Availability: Unavailable

## Sheet obc-v2_FRAM-FLASH.SchDoc
size 420 x 297 mm; SheetNumber: 8; SheetTotal: 23
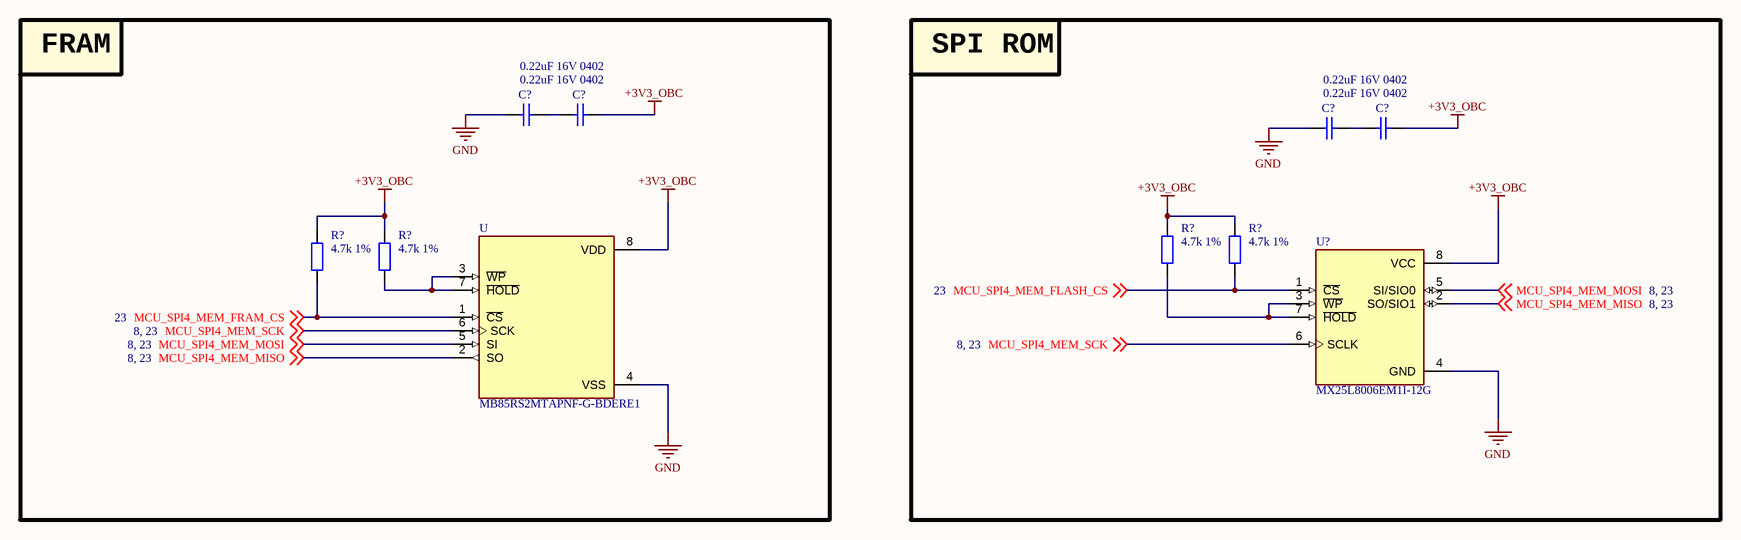
[diagram p8: obc-v2_FRAM-FLASH.SchDoc]

### Parts
(Parts that share a designator on the sheet are numbered #1, #2 ... from top to bottom, then left to right.)
C?#57  0.22uF 16V 0402  [tu 0402]
C?#58  0.22uF 16V 0402  [tu 0402]
C?#59  0.22uF 16V 0402  [tu 0402]
C?#60  0.22uF 16V 0402  [tu 0402]
R?#18  4.7k 1%  [tro smd 0603]
R?#19  4.7k 1%  [tro smd 0603]
R?#20  4.7k 1%  [tro smd 0603]
R?#21  4.7k 1%  [tro smd 0603]
U  MB85RS2MTAPNF-G-BDERE1  [SOIC127P602X173-8N]
U?#12  MX25L8006EM1I-12G  [SOIC127P600X175-8N]

### Blocks framed on the sheet
FRAM: C?#57 C?#58 R?#20 R?#21 U
SPI ROM: C?#59 C?#60 R?#18 R?#19 U?#12

### Nets
+3V3_OBC: C?#58.1 C?#60.1 R?#18.2 R?#19.2 R?#20.2 R?#21.2 U.8(VDD) U?#12.8(VCC)
GND: C?#57.2 C?#59.2 U.4(VSS) U?#12.4(GND)
MCU_SPI4_MEM_FLASH_CS: R?#19.1 U?#12.1(~{CS}) ; off-sheet MCU_SPI4_MEM_FLASH_CS
MCU_SPI4_MEM_FRAM_CS: R?#20.1 U.1(~{CS}) ; off-sheet MCU_SPI4_MEM_FRAM_CS
MCU_SPI4_MEM_MISO: U.2(SO) U?#12.2(SO/SIO1) ; off-sheet MCU_SPI4_MEM_MISO
MCU_SPI4_MEM_MOSI: U.5(SI) U?#12.5(SI/SIO0) ; off-sheet MCU_SPI4_MEM_MOSI
MCU_SPI4_MEM_SCK: U.6(SCK) U?#12.6(SCLK) ; off-sheet MCU_SPI4_MEM_SCK
NetC?#57_1: C?#57.1 C?#58.2
NetC?#59_1: C?#59.1 C?#60.2
NetR?#18_1: R?#18.1 U?#12.3(~{WP}) U?#12.7(~{HOLD})
NetR?#21_1: R?#21.1 U.3(~{WP}) U.7(~{HOLD})

### Notes on the sheet
- Project:
- Sub-system:
- Design by:
- Sheet title:
- Sheet
- A3
- of
- Checked by:
- Approved by:
- Revision:
- Document No:
- Size:
- Date:

### Library data of the parts
C?#57-C?#60 = Tu 0402 33nF 10V: as C?#1 on sheet obc-v2_POWER; Kieu_Chan: *
R?#18-R?#21 = Tro 0603 1% 10k: as R?#2 on sheet obc-v2_OUT-eMMC; Kieu_Chan: *
U = MB85RS2MTAPNF-G-BDERE1: FRAM _Ferroelectric RAM_ Memory IC 2Mb _256K x 8_ SPI 40MHz 8-SOP; MF: Fujitsu Electronics; Package: SO-8 Fujitsu; Value: *; Digi-Key_Purchase_URL: https://www.digikey.com/product-detail/en/fujitsu-electronics-america-inc/MB85RS2MTAPNF-G-BDERE1/865-1286-1-ND/7916252?utm_source=snapeda&utm_medium=aggregator&utm_campaign=symbol; Digi-Key_Part_Number: 865-1286-1-ND; SnapEDA_Link: https://www.snapeda.com/parts/MB85RS2MTAPNF-G-BDERE1/Fujitsu%20Electronics%20America%2C%20Inc./view-part/2344795/?ref=snap; MP: MB85RS2MTAPNF-G-BDERE1
U?#12 = MX25L8006EM1I-12G: FLASH - NOR Memory IC 8Mb (1M x 8) SPI 86 MHz 8-SOP; MF: Macronix; SnapEDA_Link: https://www.snapeda.com/parts/MX25L8006EM1I-12G/Macronix/view-part/?ref=snap; Package: SOP-8 Macronix; Value: *; MP: MX25L8006EM1I-12G; Check_prices: https://www.snapeda.com/parts/MX25L8006EM1I-12G/Macronix/view-part/?ref=eda

## Sheet obc-v2_BOARD-CONNECT.SchDoc
size 420 x 297 mm; SheetNumber: 9; SheetTotal: 23
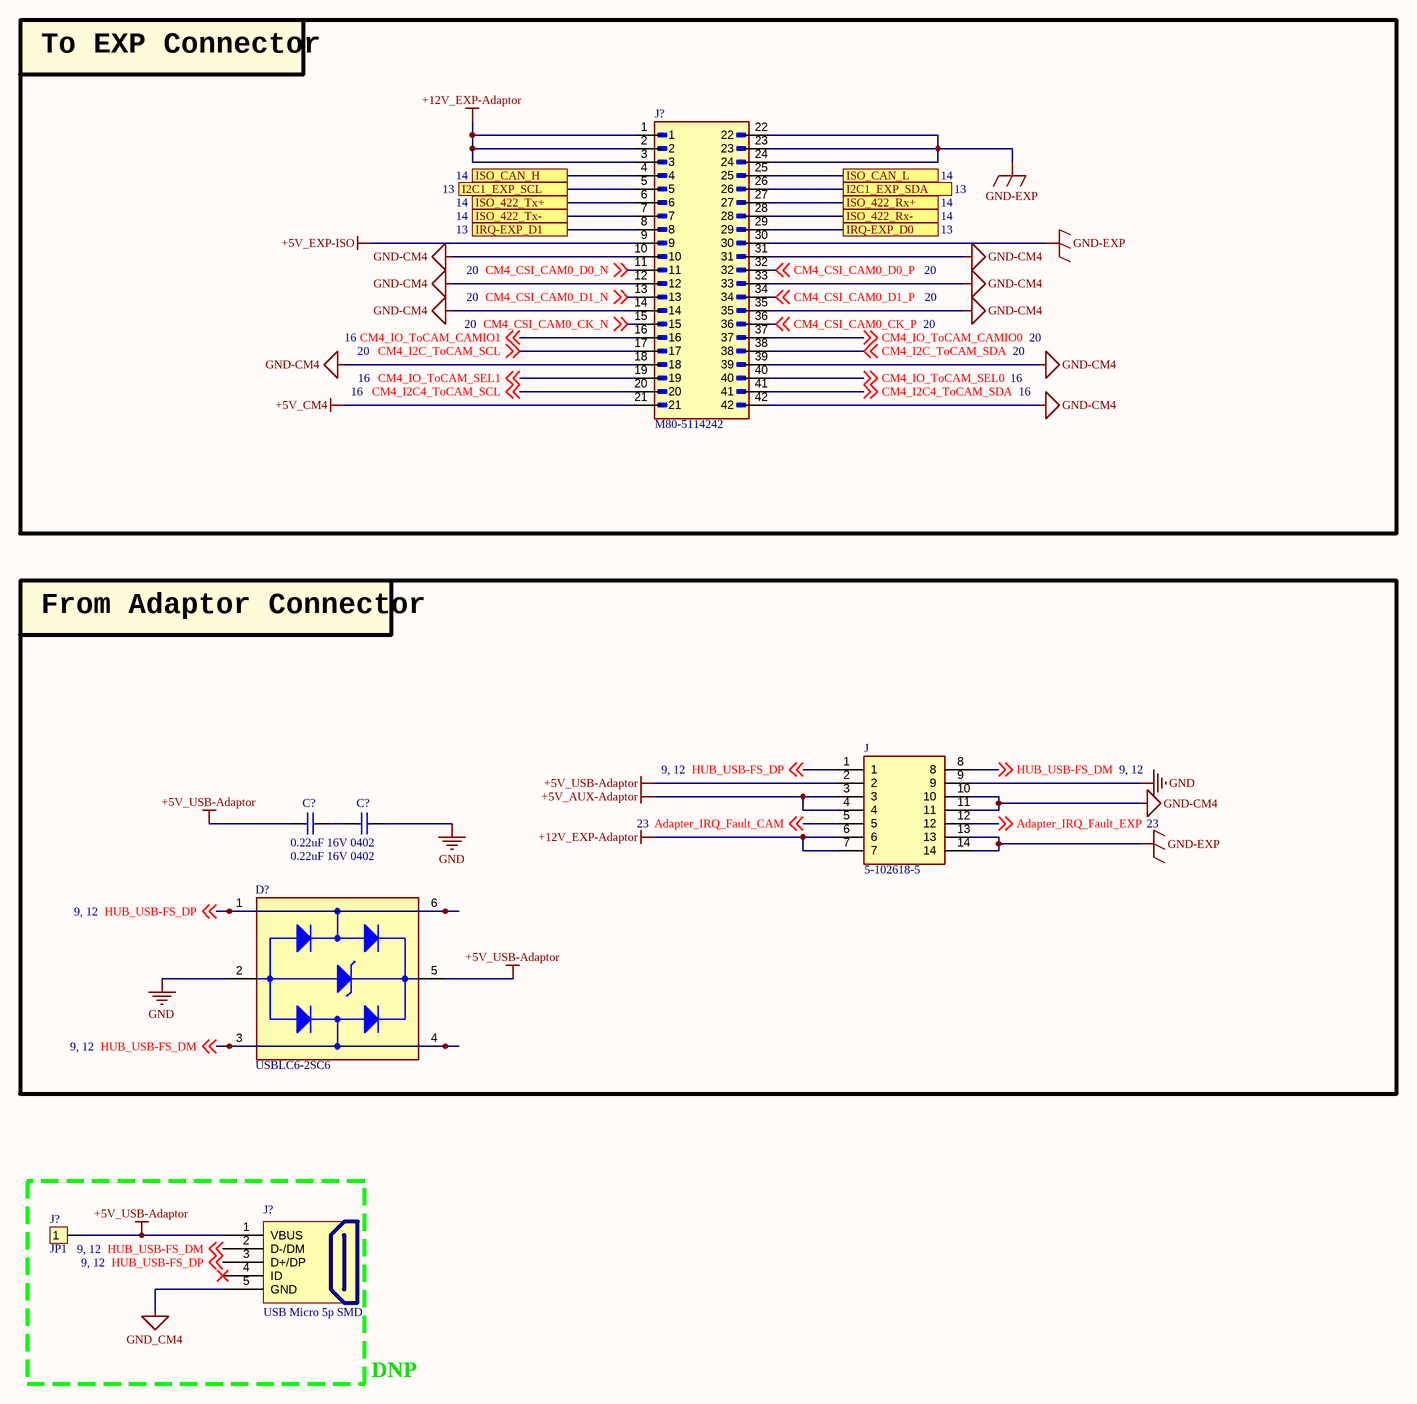
[diagram p9: obc-v2_BOARD-CONNECT.SchDoc]

### Parts
(Parts that share a designator on the sheet are numbered #1, #2 ... from top to bottom, then left to right.)
C?#61  0.22uF 16V 0402  [tu 0402]
C?#62  0.22uF 16V 0402  [tu 0402]
D?#3  USBLC6-2SC6  [SOT95P280X145-6N]
J  5-102618-5  [TE_5-102618-5]
J?#3  M80-5114242  [HARWIN_M80-5114242]
J?#4  JP1  [JP1-D1T]
J?#5  USB Micro 5p SMD  [USB Micro 5p SMD]

### Blocks framed on the sheet
To EXP Connector: J?#3
From Adaptor Connector: C?#61 C?#62 D?#3 J

### Ports
I2C1_EXP_SCL (see 13), I2C1_EXP_SDA (see 13), IRQ-EXP_D0 (see 13), IRQ-EXP_D1 (see 13), ISO_422_Rx+ (see 14), ISO_422_Rx- (see 14), ISO_422_Tx+ (see 14), ISO_422_Tx- (see 14), ISO_CAN_H (see 14), ISO_CAN_L (see 14)

### Nets
+5V_AUX-Adaptor: J.3 J.4 J?#3.21  [also labelled +5V_CM4]
+5V_EXP-ISO: J?#3.9
+5V_USB-Adaptor: C?#61.2 D?#3.5(VBUS) J.2 J?#4.1 J?#5.1(VBUS)
+12V_EXP-Adaptor: J.6 J.7 J?#3.1 J?#3.2 J?#3.3
GND: C?#62.1 D?#3.2(GND) J.9
GND-CM4: J.10 J.11 J?#3.10 J?#3.12 J?#3.14 J?#3.18 J?#3.31 J?#3.33 J?#3.35 J?#3.39 J?#3.42
GND-EXP: J.13 J.14 J?#3.22 J?#3.23 J?#3.24 J?#3.30
GND_CM4: J?#5.5(GND)  [project net +3V3_M2]
Adapter_IRQ_Fault_CAM: J.5 ; off-sheet Adapter_IRQ_Fault_CAM
Adapter_IRQ_Fault_EXP: J.12 ; off-sheet Adapter_IRQ_Fault_EXP
CM4_CSI_CAM0_CK_N: J?#3.15 ; off-sheet CM4_CSI_CAM0_CK_N  [project net CAM0_CK_N]
CM4_CSI_CAM0_CK_P: J?#3.36 ; off-sheet CM4_CSI_CAM0_CK_P  [project net CAM0_CK_P]
CM4_CSI_CAM0_D0_N: J?#3.11 ; off-sheet CM4_CSI_CAM0_D0_N  [project net CAM0_D0_N]
CM4_CSI_CAM0_D0_P: J?#3.32 ; off-sheet CM4_CSI_CAM0_D0_P  [project net CAM0_D0_P]
CM4_CSI_CAM0_D1_N: J?#3.13 ; off-sheet CM4_CSI_CAM0_D1_N  [project net CAM0_D1_N]
CM4_CSI_CAM0_D1_P: J?#3.34 ; off-sheet CM4_CSI_CAM0_D1_P  [project net CAM0_D1_P]
CM4_I2C4_ToCAM_SCL: J?#3.20 ; off-sheet CM4_I2C4_ToCAM_SCL
CM4_I2C4_ToCAM_SDA: J?#3.41 ; off-sheet CM4_I2C4_ToCAM_SDA
CM4_I2C_ToCAM_SCL: J?#3.17 ; off-sheet CM4_I2C_ToCAM_SCL
CM4_I2C_ToCAM_SDA: J?#3.38 ; off-sheet CM4_I2C_ToCAM_SDA
CM4_IO_ToCAM_CAMIO0: J?#3.37 ; off-sheet CM4_IO_ToCAM_CAMIO0
CM4_IO_ToCAM_CAMIO1: J?#3.16 ; off-sheet CM4_IO_ToCAM_CAMIO1
CM4_IO_ToCAM_SEL0: J?#3.40 ; off-sheet CM4_IO_ToCAM_SEL0
CM4_IO_ToCAM_SEL1: J?#3.19 ; off-sheet CM4_IO_ToCAM_SEL1
HUB_USB-FS_DM: D?#3.3(I/O2_IN) D?#3.4(I/O2_OUT) J.8 J?#5.2(D-/DM) ; off-sheet HUB_USB-FS_DM  [project net HUB_USB-FS_D_N]
HUB_USB-FS_DP: D?#3.1(I/O1_IN) D?#3.6(I/O1_OUT) J.1 J?#5.3(D+/DP) ; off-sheet HUB_USB-FS_DP  [project net HUB_USB-FS_D_P]
Rx+: J?#3.27 ; port ISO_422_Rx+
Rx-: J?#3.28 ; port ISO_422_Rx-
Tx+: J?#3.6 ; port ISO_422_Tx+
Tx-: J?#3.7 ; port ISO_422_Tx-
NetC?#61_1: C?#61.1 C?#62.2
NetJ?#3_4: J?#3.4 ; port ISO_CAN_H
NetJ?#3_5: J?#3.5 ; port I2C1_EXP_SCL
NetJ?#3_8: J?#3.8 ; port IRQ-EXP_D1
NetJ?#3_25: J?#3.25 ; port ISO_CAN_L
NetJ?#3_26: J?#3.26 ; port I2C1_EXP_SDA
NetJ?#3_29: J?#3.29 ; port IRQ-EXP_D0

Not connected (* = marked no-connect by the designer): J?#5 4(ID)*

### Notes on the sheet
- DNP
- Project:
- Sub-system:
- Design by:
- Sheet title:
- Sheet
- A3
- of
- Checked by:
- Approved by:
- Revision:
- Document No:
- Size:
- Date:

### Library data of the parts
C?#61 C?#62 = Tu 0402 33nF 10V: as C?#1 on sheet obc-v2_POWER; Kieu_Chan: *
D?#3 = USBLC6-2SC6: 17V Clamp 5A (8/20Âµs) Ipp Tvs Diode Surface Mount SOT-23-6; MF: STMicroelectronics; Value: *; SnapEDA_Link: https://www.snapeda.com/parts/USBLC6-2SC6/STMicroelectronics/view-part/?ref=snap; Check_prices: https://www.snapeda.com/parts/USBLC6-2SC6/STMicroelectronics/view-part/?ref=eda; Purchase-URL: https://pricing.snapeda.com/search/part/USBLC6-2SC6/?ref=eda; Price: None; Availability: In Stock; Package: SOT-23-6 STMicroelectronics; MP: USBLC6-2SC6
J = 5-102618-5: Conn Shrouded Header HDR 14 POS 2.54mm Solder ST Thru-Hole Tray; MF: TE Connectivity; Value: *; Availability: Unavailable; Package: None; Price: None; SnapEDA_Link: https://www.snapeda.com/parts/5-102618-5/TE%20Connectivity%20AMP%20Connectors/view-part/367931/?ref=snap; MP: 5-102618-5
J?#4 = JP1: as J?#2 on sheet obc-v2_RTC-WDOG; Created Date: 29 March 2013; ComponentLink1URL: http://www.we-online.com; ComponentLink2URL: http://katalog.we-online.de/em/datasheet/6130xx143121.pdf; Created by: Karrer Zheng
J?#5 = USB Micro 5p SMD: USB Type B; Ten: MicroUSB MK5P SMD; Ma_Hang: MH001020
J?#3 = M80-5114242: Package: None; Price: None; Value: *; MP: M80-5114242; Availability: Unavailable

## Sheet obc-v2_GADGET-CONNECT.SchDoc
size 420 x 297 mm; SheetNumber: 10; SheetTotal: 23

### Notes on the sheet
- Project:
- Sub-system:
- Design by:
- Sheet title:
- Sheet
- A3
- of
- Checked by:
- Approved by:
- Revision:
- Document No:
- Size:
- Date:

## Sheet obc-v2_DEBUG.SchDoc
size 420 x 297 mm; SheetNumber: 11; SheetTotal: 23
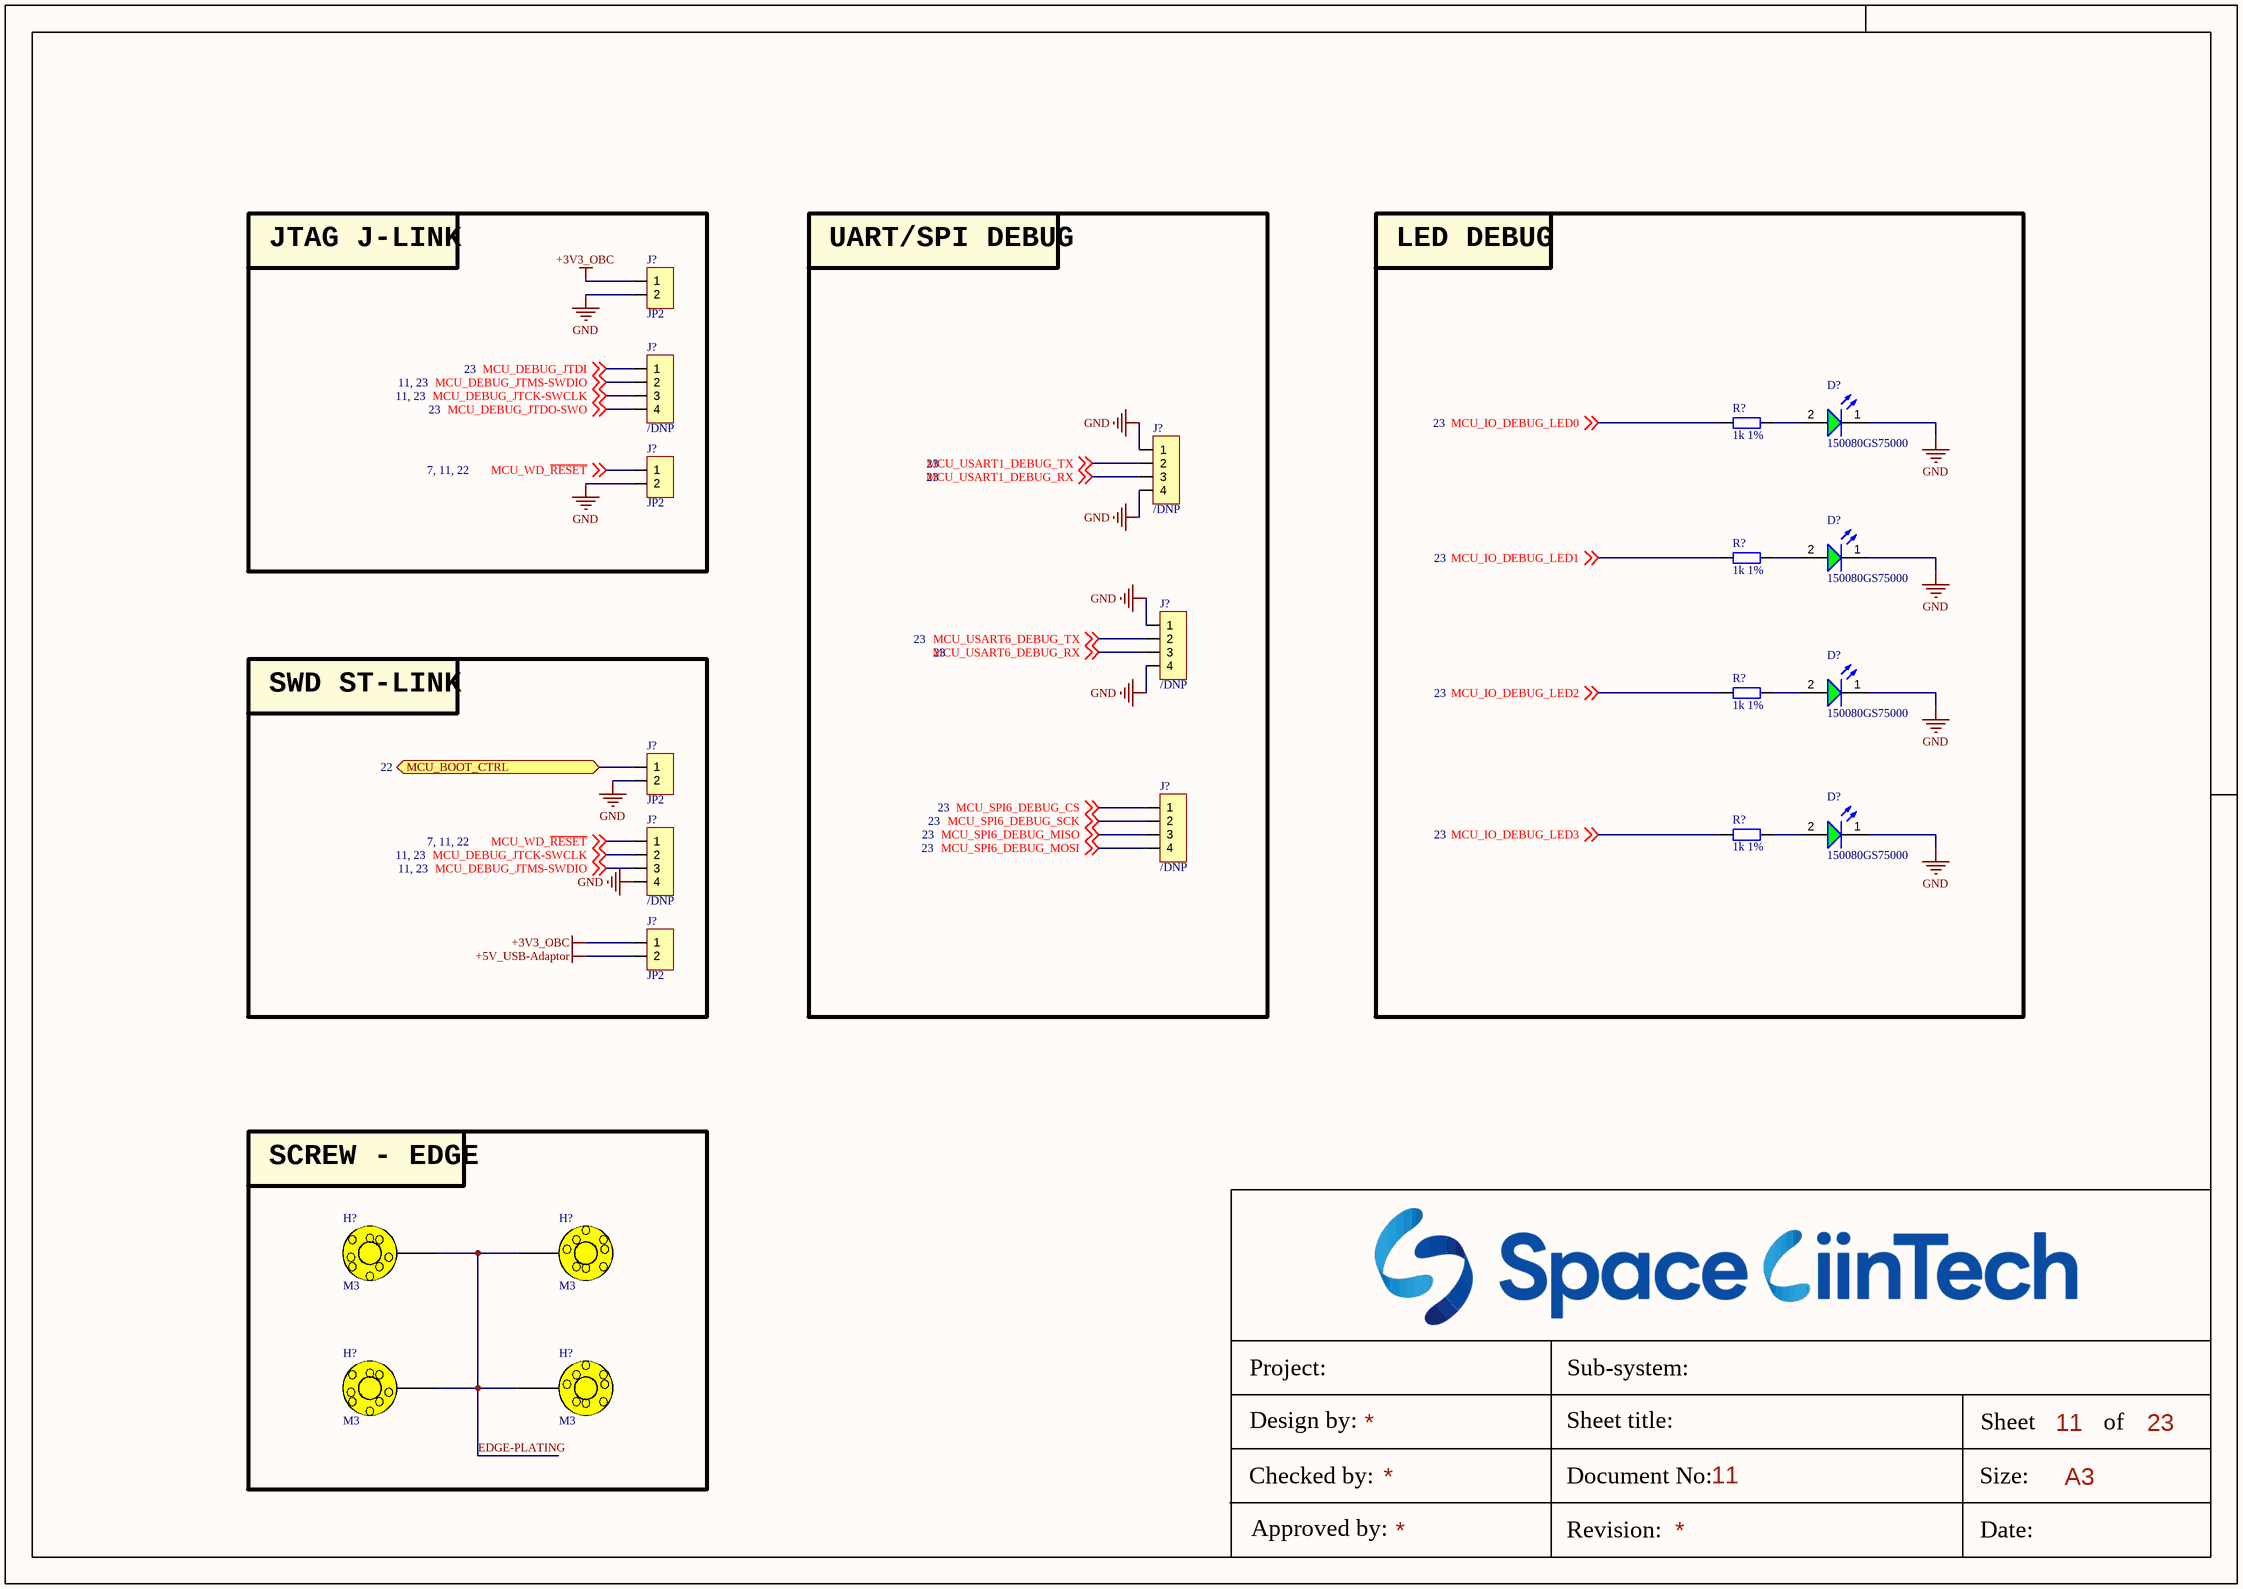
[diagram p10: obc-v2_DEBUG.SchDoc]

### Parts
(Parts that share a designator on the sheet are numbered #1, #2 ... from top to bottom, then left to right.)
D?#4  150080GS75000  [WL-SMCW_0805_150080xx75000]
D?#5  150080GS75000  [WL-SMCW_0805_150080xx75000]
D?#6  150080GS75000  [WL-SMCW_0805_150080xx75000]
D?#7  150080GS75000  [WL-SMCW_0805_150080xx75000]
H?#1  M3  [HEX-M3]
H?#2  M3  [HEX-M3]
H?#3  M3  [HEX-M3]
H?#4  M3  [HEX-M3]
J?#6  JP2  [JP2-D1T]
J?#7  /DNP  [JP4-C1T]
J?#8  /DNP  [JP4-C1T]
J?#9  JP2  [JP2-D1T]
J?#10  /DNP  [JP4-C1T]
J?#11  JP2  [JP2-D1T]
J?#12  /DNP  [JP4-C1T]
J?#13  /DNP  [JP4-C1T]
J?#14  JP2  [JP2-D1T]
R?#22  1k 1%  [tro smd 0603]
R?#23  1k 1%  [tro smd 0603]
R?#24  1k 1%  [tro smd 0603]
R?#25  1k 1%  [tro smd 0603]

### Blocks framed on the sheet
JTAG J-LINK: J?#6 J?#7 J?#9
UART/SPI DEBUG: J?#8 J?#10 J?#12
LED DEBUG: D?#4-D?#7 R?#22-R?#25
SWD ST-LINK: J?#11 J?#13 J?#14
SCREW - EDGE: H?#1-H?#4

### Ports
MCU_BOOT_CTRL (bidir, see 22)

### Nets
+3V3_OBC: J?#6.1 J?#14.1
+5V_USB-Adaptor: J?#14.2
GND: D?#4.1(K) D?#5.1(K) D?#6.1(K) D?#7.1(K) J?#6.2 J?#8.1 J?#8.4 J?#9.2 J?#10.1 J?#10.4 J?#11.2 J?#13.4
EDGE-PLATING: H?#1.1 H?#2.1 H?#3.1 H?#4.1
MCU_BOOT0: J?#11.1 ; port MCU_BOOT_CTRL
MCU_DEBUG_JTCK-SWCLK: J?#7.3 J?#13.2 ; off-sheet MCU_DEBUG_JTCK-SWCLK
MCU_DEBUG_JTDI: J?#7.1 ; off-sheet MCU_DEBUG_JTDI
MCU_DEBUG_JTDO-SWO: J?#7.4 ; off-sheet MCU_DEBUG_JTDO-SWO
MCU_DEBUG_JTMS-SWDIO: J?#7.2 J?#13.3 ; off-sheet MCU_DEBUG_JTMS-SWDIO
MCU_IO_DEBUG_LED0: R?#22.2 ; off-sheet MCU_IO_DEBUG_LED0
MCU_IO_DEBUG_LED1: R?#23.2 ; off-sheet MCU_IO_DEBUG_LED1
MCU_IO_DEBUG_LED2: R?#24.2 ; off-sheet MCU_IO_DEBUG_LED2
MCU_IO_DEBUG_LED3: R?#25.2 ; off-sheet MCU_IO_DEBUG_LED3
MCU_SPI6_DEBUG_CS: J?#12.1 ; off-sheet MCU_SPI6_DEBUG_CS
MCU_SPI6_DEBUG_MISO: J?#12.3 ; off-sheet MCU_SPI6_DEBUG_MISO
MCU_SPI6_DEBUG_MOSI: J?#12.4 ; off-sheet MCU_SPI6_DEBUG_MOSI
MCU_SPI6_DEBUG_SCK: J?#12.2 ; off-sheet MCU_SPI6_DEBUG_SCK
MCU_USART1_DEBUG_RX: J?#8.3 ; off-sheet MCU_USART1_DEBUG_RX
MCU_USART1_DEBUG_TX: J?#8.2 ; off-sheet MCU_USART1_DEBUG_TX
MCU_USART6_DEBUG_RX: J?#10.3 ; off-sheet MCU_USART6_DEBUG_RX
MCU_USART6_DEBUG_TX: J?#10.2 ; off-sheet MCU_USART6_DEBUG_TX
MCU_WD_~{RESET}: J?#9.1 J?#13.1 ; off-sheet MCU_WD_~{RESET}  [project net MCU_~{RST}]
NetD?#4_2: D?#4.2(A) R?#22.1
NetD?#5_2: D?#5.2(A) R?#23.1
NetD?#6_2: D?#6.2(A) R?#24.1
NetD?#7_2: D?#7.2(A) R?#25.1

### Notes on the sheet
- Project:
- Sub-system:
- Design by:
- Sheet title:
- Sheet
- A3
- of
- Checked by:
- Approved by:
- Revision:
- Document No:
- Size:
- Date:

### Library data of the parts
D?#4-D?#7 = CMP-1426-00007-2: NexarPartId: 29717780; Wavelength: 520nm; Forward Current: 100mA; Lens Style: Clear, Rectangular; Dominant Wavelength: 525nm; Max Junction Temperature (Tj): 95°C; Power Dissipation: 105mW; Luminous Intensity: 450mcd; Peak Wavelength: 515nm; Color: Green; Viewing Angle: 140°; Test Current: 20mA; Reverse Voltage: 5V; Forward Voltage: 3.2V; Mount: Surface Mount; REACH SVHC: Unknown; Min Operating Temperature: -40°C; Case Code (Imperial): 0805; Case/Package: 0805; Max Operating Temperature: 85°C; RoHS: Compliant; Length: 2mm; Height: 700µm; Width: 1.25mm; Case Code (Metric): 2012; Packaging: Tape and Reel; Max Reverse Voltage (DC): 5V
H?#1-H?#4 = HEX-M3
J?#6 J?#9 J?#11 J?#14 = JP2: WR-PHD 2.54 mm Angled Socket Header; Manufacturer: W¨¹rth Elektronik eiSos GmbH; partNo: 613002143121; ComponentLink1 Description: Manufacturer; ComponentLink2 Description: Datasheet; NoPins: 02; Created Date: 29 March 2013; ComponentLink1URL: http://www.we-online.com; ComponentLink2URL: http://katalog.we-online.de/em/datasheet/6130xx143121.pdf; Created by: Karrer Zheng
J?#7 J?#8 J?#10 J?#12 J?#13 = JP4: WR-PHD 2.54 mm Angled Socket Header; Manufacturer: W¨¹rth Elektronik eiSos GmbH; partNo: 613004143121; ComponentLink1 Description: Manufacturer; ComponentLink2 Description: Datasheet; NoPins: 04; Created Date: 29 March 2013; ComponentLink1URL: http://www.we-online.com; ComponentLink2URL: http://katalog.we-online.de/em/datasheet/6130xx143121.pdf; Created by: Karrer Zheng
R?#22-R?#25 = Tro 0603 1% 10k: RES SMD 1K OHM 1% 1/10W 0603, P/N: ERJ-3EKF1001V; Chung_Loai: Dán; Don_Vi: Con; So_Chan: 2; Ten_Linh_Kien: Trở 0603 1% 10k; Ma_Hang: MH006333; Kieu_Chan: *

## Sheet obc-v2_USB-HUB.SchDoc
size 420 x 297 mm; SheetNumber: 12; SheetTotal: 23
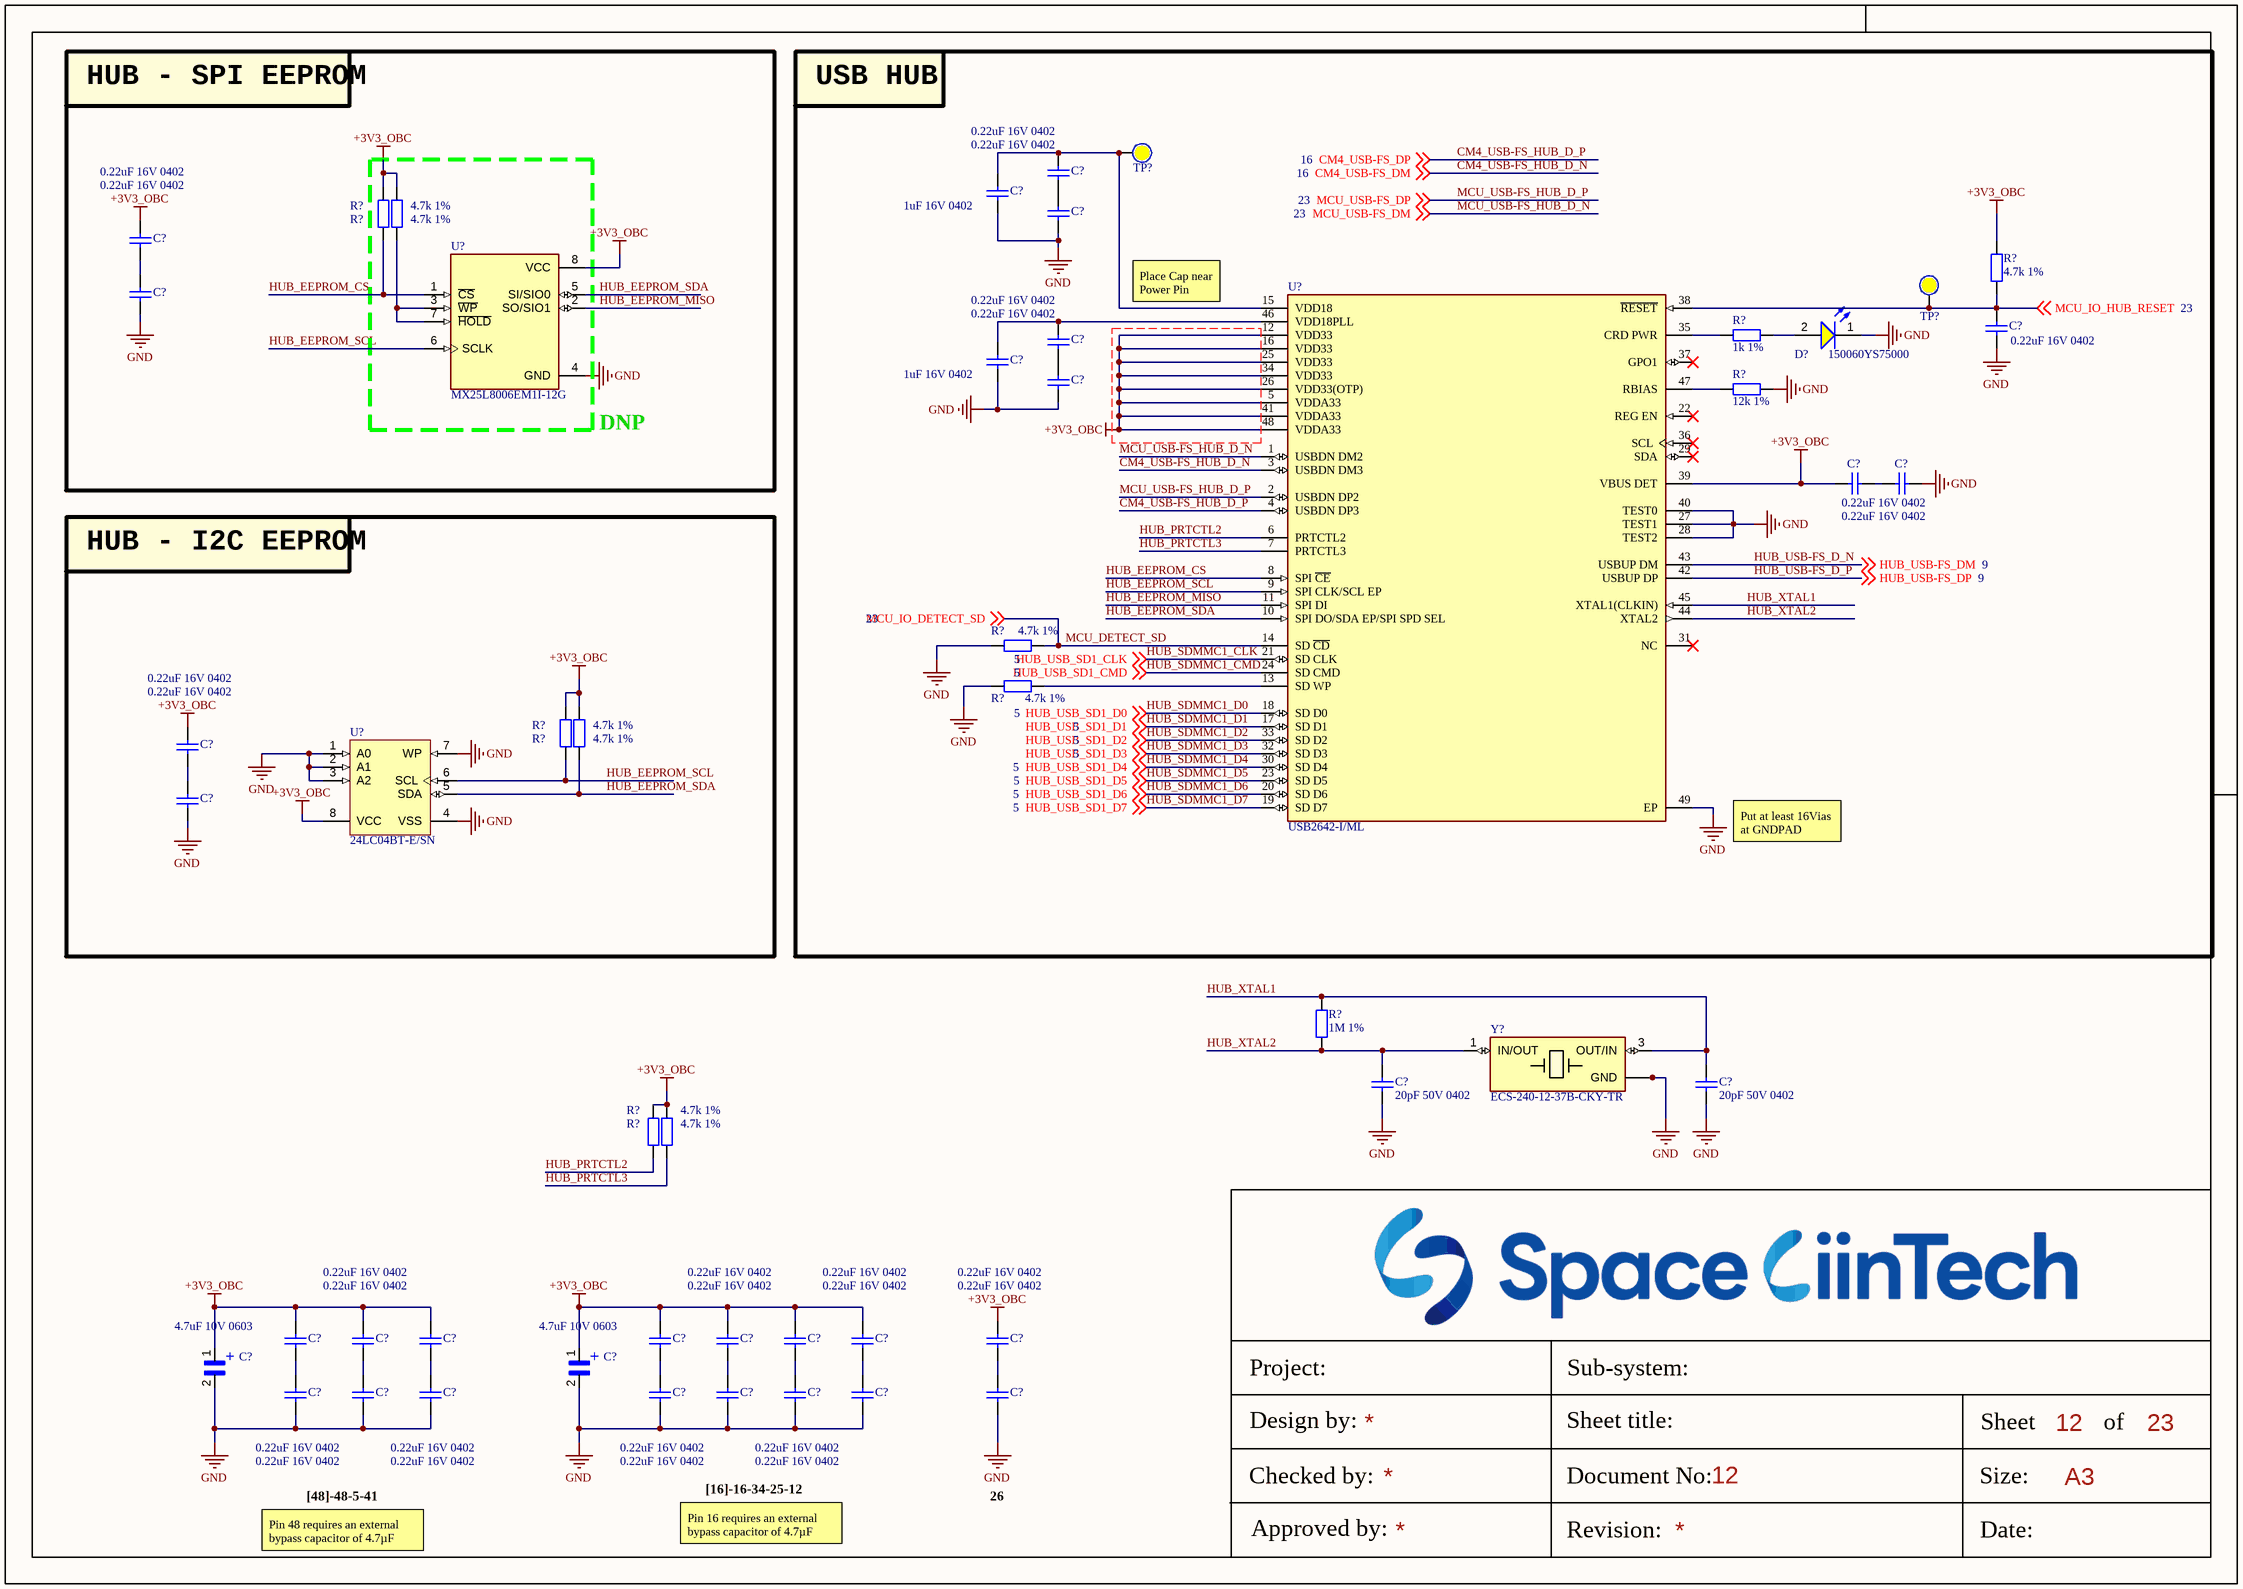
[diagram p11: obc-v2_USB-HUB.SchDoc]

### Parts
(Parts that share a designator on the sheet are numbered #1, #2 ... from top to bottom, then left to right.)
C?#63  0.22uF 16V 0402  [tu 0402]
C?#64  1uF 16V 0402  [tu 0402]
C?#65  0.22uF 16V 0402  [tu 0402]
C?#66  0.22uF 16V 0402  [tu 0402]
C?#67  0.22uF 16V 0402  [tu 0402]
C?#68  0.22uF 16V 0402  [tu 0402]
C?#69  0.22uF 16V 0402  [tu 0402]
C?#70  1uF 16V 0402  [tu 0402]
C?#71  0.22uF 16V 0402  [tu 0402]
C?#72  0.22uF 16V 0402  [tu 0402]
C?#73  0.22uF 16V 0402  [tu 0402]
C?#74  0.22uF 16V 0402  [tu 0402]
C?#75  0.22uF 16V 0402  [tu 0402]
C?#76  20pF 50V 0402  [tu 0402]
C?#77  20pF 50V 0402  [tu 0402]
C?#78  0.22uF 16V 0402  [tu 0402]
C?#79  0.22uF 16V 0402  [tu 0402]
C?#80  0.22uF 16V 0402  [tu 0402]
C?#81  0.22uF 16V 0402  [tu 0402]
C?#82  0.22uF 16V 0402  [tu 0402]
C?#83  0.22uF 16V 0402  [tu 0402]
C?#84  0.22uF 16V 0402  [tu 0402]
C?#85  0.22uF 16V 0402  [tu 0402]
C?#86  4.7uF 10V 0603  [CAPC1608X90]
C?#87  4.7uF 10V 0603  [CAPC1608X90]
C?#88  0.22uF 16V 0402  [tu 0402]
C?#89  0.22uF 16V 0402  [tu 0402]
C?#90  0.22uF 16V 0402  [tu 0402]
C?#91  0.22uF 16V 0402  [tu 0402]
C?#92  0.22uF 16V 0402  [tu 0402]
C?#93  0.22uF 16V 0402  [tu 0402]
C?#94  0.22uF 16V 0402  [tu 0402]
C?#95  0.22uF 16V 0402  [tu 0402]
D?#8  150060YS75000  [WL-SMCW_0603_150060xx75000]
R?#26  4.7k 1%  [tro smd 0603]
R?#27  4.7k 1%  [tro smd 0603]
R?#28  4.7k 1%  [tro smd 0603]
R?#29  1k 1%  [tro smd 0603]
R?#30  12k 1%  [tro smd 0603]
R?#31  4.7k 1%  [tro smd 0603]
R?#32  4.7k 1%  [tro smd 0603]
R?#33  4.7k 1%  [tro smd 0603]
R?#34  4.7k 1%  [tro smd 0603]
R?#35  1M 1%  [tro smd 0603]
R?#36  4.7k 1%  [tro smd 0603]
R?#37  4.7k 1%  [tro smd 0603]
TP?#4  (no value)  [Test Point 1 Side]  (no BOM)
TP?#5  (no value)  [Test Point 1 Side]  (no BOM)
U?#13  USB2642-I/ML  [FP-48QFN-5304-7x7B-IPC_A]
U?#14  MX25L8006EM1I-12G  [SOIC127P600X175-8N]
U?#15  24LC04BT-E/SN  [SOIC-SN8_L]
Y?#1  ECS-240-12-37B-CKY-TR  [XTAL_ECS-240-12-37B-CKY-TR]

### Blocks framed on the sheet
HUB - SPI EEPROM: C?#66 C?#67 R?#26 R?#27 U?#14
USB HUB: C?#63-C?#65 C?#68-C?#73 D?#8 R?#28-R?#32 TP?#4 TP?#5 U?#13
HUB - I2C EEPROM: C?#74 C?#75 R?#33 R?#34 U?#15

### Nets
+3V3_OBC: C?#66.1 C?#72.1 C?#74.1 C?#78.1 C?#79.1 C?#80.1 C?#81.1 C?#82.1 C?#83.1 C?#84.1 C?#85.1 C?#86.1 C?#87.1 R?#26.2 R?#27.2 R?#28.1 R?#33.2 R?#34.2 R?#36.1 R?#37.1 U?#13.5(VDDA33) U?#13.12(VDD33) U?#13.16(VDD33) U?#13.25(VDD33) U?#13.26(VDD33(OTP)) U?#13.34(VDD33) U?#13.39(VBUS_DET) U?#13.41(VDDA33) U?#13.48(VDDA33) U?#14.8(VCC) U?#15.8(VCC)
GND: C?#64.1 C?#65.1 C?#67.2 C?#68.2 C?#70.1 C?#71.1 C?#73.2 C?#75.2 C?#76.1 C?#77.1 C?#86.2 C?#87.2 C?#88.2 C?#89.2 C?#90.2 C?#91.2 C?#92.2 C?#93.2 C?#94.2 C?#95.2 D?#8.1(K) R?#30.2 R?#31.1 R?#32.1 U?#13.27(TEST1) U?#13.28(TEST2) U?#13.40(TEST0) U?#13.49(EP) U?#14.4(GND) U?#15.1(A0) U?#15.2(A1) U?#15.3(A2) U?#15.4(VSS) U?#15.7(WP) Y?#1.2(GND) Y?#1.4(GND)
CM4_USB-FS_HUB_D_N: U?#13.3(USBDN_DM3) ; off-sheet CM4_USB-FS_DM  [also labelled CM4_USB-FS_DM]
CM4_USB-FS_HUB_D_P: U?#13.4(USBDN_DP3) ; off-sheet CM4_USB-FS_DP  [also labelled CM4_USB-FS_DP]
HUB_EEPROM_CS: R?#26.1 U?#13.8(SPI_~{CE}) U?#14.1(~{CS})
HUB_EEPROM_MISO: U?#13.11(SPI_DI) U?#14.2(SO/SIO1)
HUB_EEPROM_SCL: R?#33.1 U?#13.9(SPI_CLK/SCL_EP) U?#14.6(SCLK) U?#15.6(SCL)
HUB_EEPROM_SDA: R?#34.1 U?#13.10(SPI_DO/SDA_EP/SPI_SPD_SEL) U?#14.5(SI/SIO0) U?#15.5(SDA)
HUB_PRTCTL2: R?#36.2 U?#13.6(PRTCTL2)
HUB_PRTCTL3: R?#37.2 U?#13.7(PRTCTL3)
HUB_SDMMC1_CLK: U?#13.21(SD_CLK) ; off-sheet HUB_USB_SD1_CLK  [also labelled HUB_USB_SD1_CLK]
HUB_SDMMC1_CMD: U?#13.24(SD_CMD) ; off-sheet HUB_USB_SD1_CMD  [also labelled HUB_USB_SD1_CMD]
HUB_SDMMC1_D0: U?#13.18(SD_D0) ; off-sheet HUB_USB_SD1_D0  [also labelled HUB_USB_SD1_D0]
HUB_SDMMC1_D1: U?#13.17(SD_D1) ; off-sheet HUB_USB_SD1_D1  [also labelled HUB_USB_SD1_D1]
HUB_SDMMC1_D2: U?#13.33(SD_D2) ; off-sheet HUB_USB_SD1_D2  [also labelled HUB_USB_SD1_D2]
HUB_SDMMC1_D3: U?#13.32(SD_D3) ; off-sheet HUB_USB_SD1_D3  [also labelled HUB_USB_SD1_D3]
HUB_SDMMC1_D4: U?#13.30(SD_D4) ; off-sheet HUB_USB_SD1_D4  [also labelled HUB_USB_SD1_D4]
HUB_SDMMC1_D5: U?#13.23(SD_D5) ; off-sheet HUB_USB_SD1_D5  [also labelled HUB_USB_SD1_D5]
HUB_SDMMC1_D6: U?#13.20(SD_D6) ; off-sheet HUB_USB_SD1_D6  [also labelled HUB_USB_SD1_D6]
HUB_SDMMC1_D7: U?#13.19(SD_D7) ; off-sheet HUB_USB_SD1_D7  [also labelled HUB_USB_SD1_D7]
HUB_USB-FS_D_N: U?#13.43(USBUP_DM) ; off-sheet HUB_USB-FS_DM  [also labelled HUB_USB-FS_DM]
HUB_USB-FS_D_P: U?#13.42(USBUP_DP) ; off-sheet HUB_USB-FS_DP  [also labelled HUB_USB-FS_DP]
HUB_XTAL1: C?#77.2 R?#35.2 U?#13.45(XTAL1(CLKIN)) Y?#1.3(OUT/IN)
HUB_XTAL2: C?#76.2 R?#35.1 U?#13.44(XTAL2) Y?#1.1(IN/OUT)
MCU_DETECT_SD: R?#31.2 U?#13.14(SD_~{CD}) ; off-sheet MCU_IO_DETECT_SD  [also labelled MCU_IO_DETECT_SD]
MCU_IO_HUB_RESET: C?#68.1 R?#28.2 TP?#5.0 U?#13.38(~{RESET}) ; off-sheet MCU_IO_HUB_RESET
MCU_USB-FS_HUB_D_N: U?#13.1(USBDN_DM2) ; off-sheet MCU_USB-FS_DM  [also labelled MCU_USB-FS_DM]
MCU_USB-FS_HUB_D_P: U?#13.2(USBDN_DP2) ; off-sheet MCU_USB-FS_DP  [also labelled MCU_USB-FS_DP]
NetC?#63_1: C?#63.1 C?#65.2
NetC?#63_2: C?#63.2 C?#64.2 TP?#4.0 U?#13.15(VDD18)
NetC?#66_2: C?#66.2 C?#67.1
NetC?#69_1: C?#69.1 C?#71.2
NetC?#69_2: C?#69.2 C?#70.2 U?#13.46(VDD18PLL)
NetC?#72_2: C?#72.2 C?#73.1
NetC?#74_2: C?#74.2 C?#75.1
NetC?#78_2: C?#78.2 C?#88.1
NetC?#79_2: C?#79.2 C?#89.1
NetC?#80_2: C?#80.2 C?#90.1
NetC?#81_2: C?#81.2 C?#91.1
NetC?#82_2: C?#82.2 C?#92.1
NetC?#83_2: C?#83.2 C?#93.1
NetC?#84_2: C?#84.2 C?#94.1
NetC?#85_2: C?#85.2 C?#95.1
NetD?#8_2: D?#8.2(A) R?#29.1
NetR?#27_1: R?#27.1 U?#14.3(~{WP}) U?#14.7(~{HOLD})
NetR?#29_2: R?#29.2 U?#13.35(CRD_PWR)
NetR?#30_1: R?#30.1 U?#13.47(RBIAS)
NetR?#32_2: R?#32.2 U?#13.13(SD_WP)

Not connected (* = marked no-connect by the designer): U?#13 22(REG_EN)* 29(SDA)* 31(NC)* 36(SCL)* 37(GPO1)*

### Notes on the sheet
- Place Cap near Power Pin
- DNP
- Put at least 16Vias at GNDPAD
- [48]-48-5-41
- Pin 16 requires an external bypass capacitor of 4.7µF minimum.
- [16]-16-34-25-12
- 26
- Pin 48 requires an external bypass capacitor of 4.7µF minimum.
- Project:
- Sub-system:
- Design by:
- Sheet title:
- Sheet
- A3
- of
- Checked by:
- Approved by:
- Revision:
- Document No:
- Size:
- Date:
- (in symbol TACL335M003RTA) +

### Library data of the parts
C?#63-C?#75 C?#78-C?#85 C?#88-C?#95 = Tu 0402 33nF 10V: as C?#1 on sheet obc-v2_POWER; Kieu_Chan: *
C?#76 C?#77 = Tu 0402 33nF 10V: 27 pF ±1% 50V Ceramic Capacitor C0G, NP0 0402 (1005 Metric): GCQ1555C1H270FB01D; Chung_Loai: Dán; Don_Vi: Con; So_Chan: 2; Ten_Linh_Kien: Tụ 0402 33nF X7R 10V GRM155R71A333KA01D; Ma_Hang: MH007853; Kieu_Chan: *
C?#86 C?#87 = TACL335M003RTA: 4.7 µF Molded Tantalum Capacitors 10 V 0603 (1608 Metric) 6Ohm @ 100kHz: TP8M475M010C; Package: None; Price: None; Value: *; MP: TACL335M003RTA; Availability: Unavailable
D?#8 = CMP-1426-00005-2: as D?#1 on sheet obc-v2_POWER; Case Code (Imperial): 0603; Height: 700µm; REACH SVHC: Unknown; Dominant Wavelength: 590nm; Min Operating Temperature: -40°C; Color: Yellow; Width: 800µm; Mount: Surface Mount; Packaging: Tape and Reel; Max Operating Temperature: 85°C; RoHS: Compliant; Max Reverse Voltage (DC): 5V; Case Code (Metric): 1608; Length: 1.6mm; Case/Package: 0603
R?#26-R?#28 R?#31-R?#34 = Tro 0603 1% 10k: as R?#2 on sheet obc-v2_OUT-eMMC; Kieu_Chan: *
R?#29 R?#36 R?#37 = Tro 0603 1% 10k: as R?#1 on sheet obc-v2_POWER; Kieu_Chan: *
R?#30 R?#35 = Tro 0603 1% 1k: RES SMD 12K OHM 1% 1/10W 0603, P/N: ERJ-3EKF1202V; Chung_Loai: Dán; So_Chan: 2; Don_Vi: Con; Ten_Linh_Kien: Trở 0603 1% 1k; Ma_Hang: MH006334; Kieu_Chan: *
TP?#4 TP?#5 = Test Point: Solder: NF
U?#13 = CMP-06284-000083-1: IC INTERFACE SPECIALIZED 48QFN; Data Rate: 480Mbps; Interface: I2C; Number of Ports: 2; Operating Supply Voltage: 3.3V; Case/Package: QFN; Series: -; RoHS Compliant: Yes; Number of Pins: 48; Packaging: Tray; Package Quantity: 260; Max Operating Temperature: 85°C; Weight: 0.005309oz; Mount: Surface Mount; Min Operating Temperature: -40°C
U?#14 = MX25L8006EM1I-12G: as U?#12 on sheet obc-v2_FRAM-FLASH; SnapEDA_Link: https://www.snapeda.com/parts/MX25L8006EM1I-12G/Macronix/view-part/?ref=snap; Package: SOP-8 Macronix; Value: *; MP: MX25L8006EM1I-12G; Check_prices: https://www.snapeda.com/parts/MX25L8006EM1I-12G/Macronix/view-part/?ref=eda
U?#15 = CMP-0159-00349-1: 4Kbit, 400kHz, 2.5V, I2C Serial EEPROM, 8-Pin SOIC 150mil, Extended Temperature, Tape and Reel; Code_IPC: SOIC127P600-8; Code_JEDEC: MS-012; PackageVersion: revBB, Aug-2009; DatasheetVersion: revK, Mar-2009; PackageDescription: 8-Lead Plastic Small Outline (SN) - Narrow, 3.90mm Body [SOIC]; PackageReference: SOIC-SN8
Y?#1 = ECS-240-12-37B-CKY-TR: Package: None; Price: None; Value: *; MP: ECS-240-12-37B-CKY-TR; Availability: Unavailable

## Sheet obc-v2_EXP-I2C-IRQ.SchDoc
size 420 x 297 mm; SheetNumber: 13; SheetTotal: 23
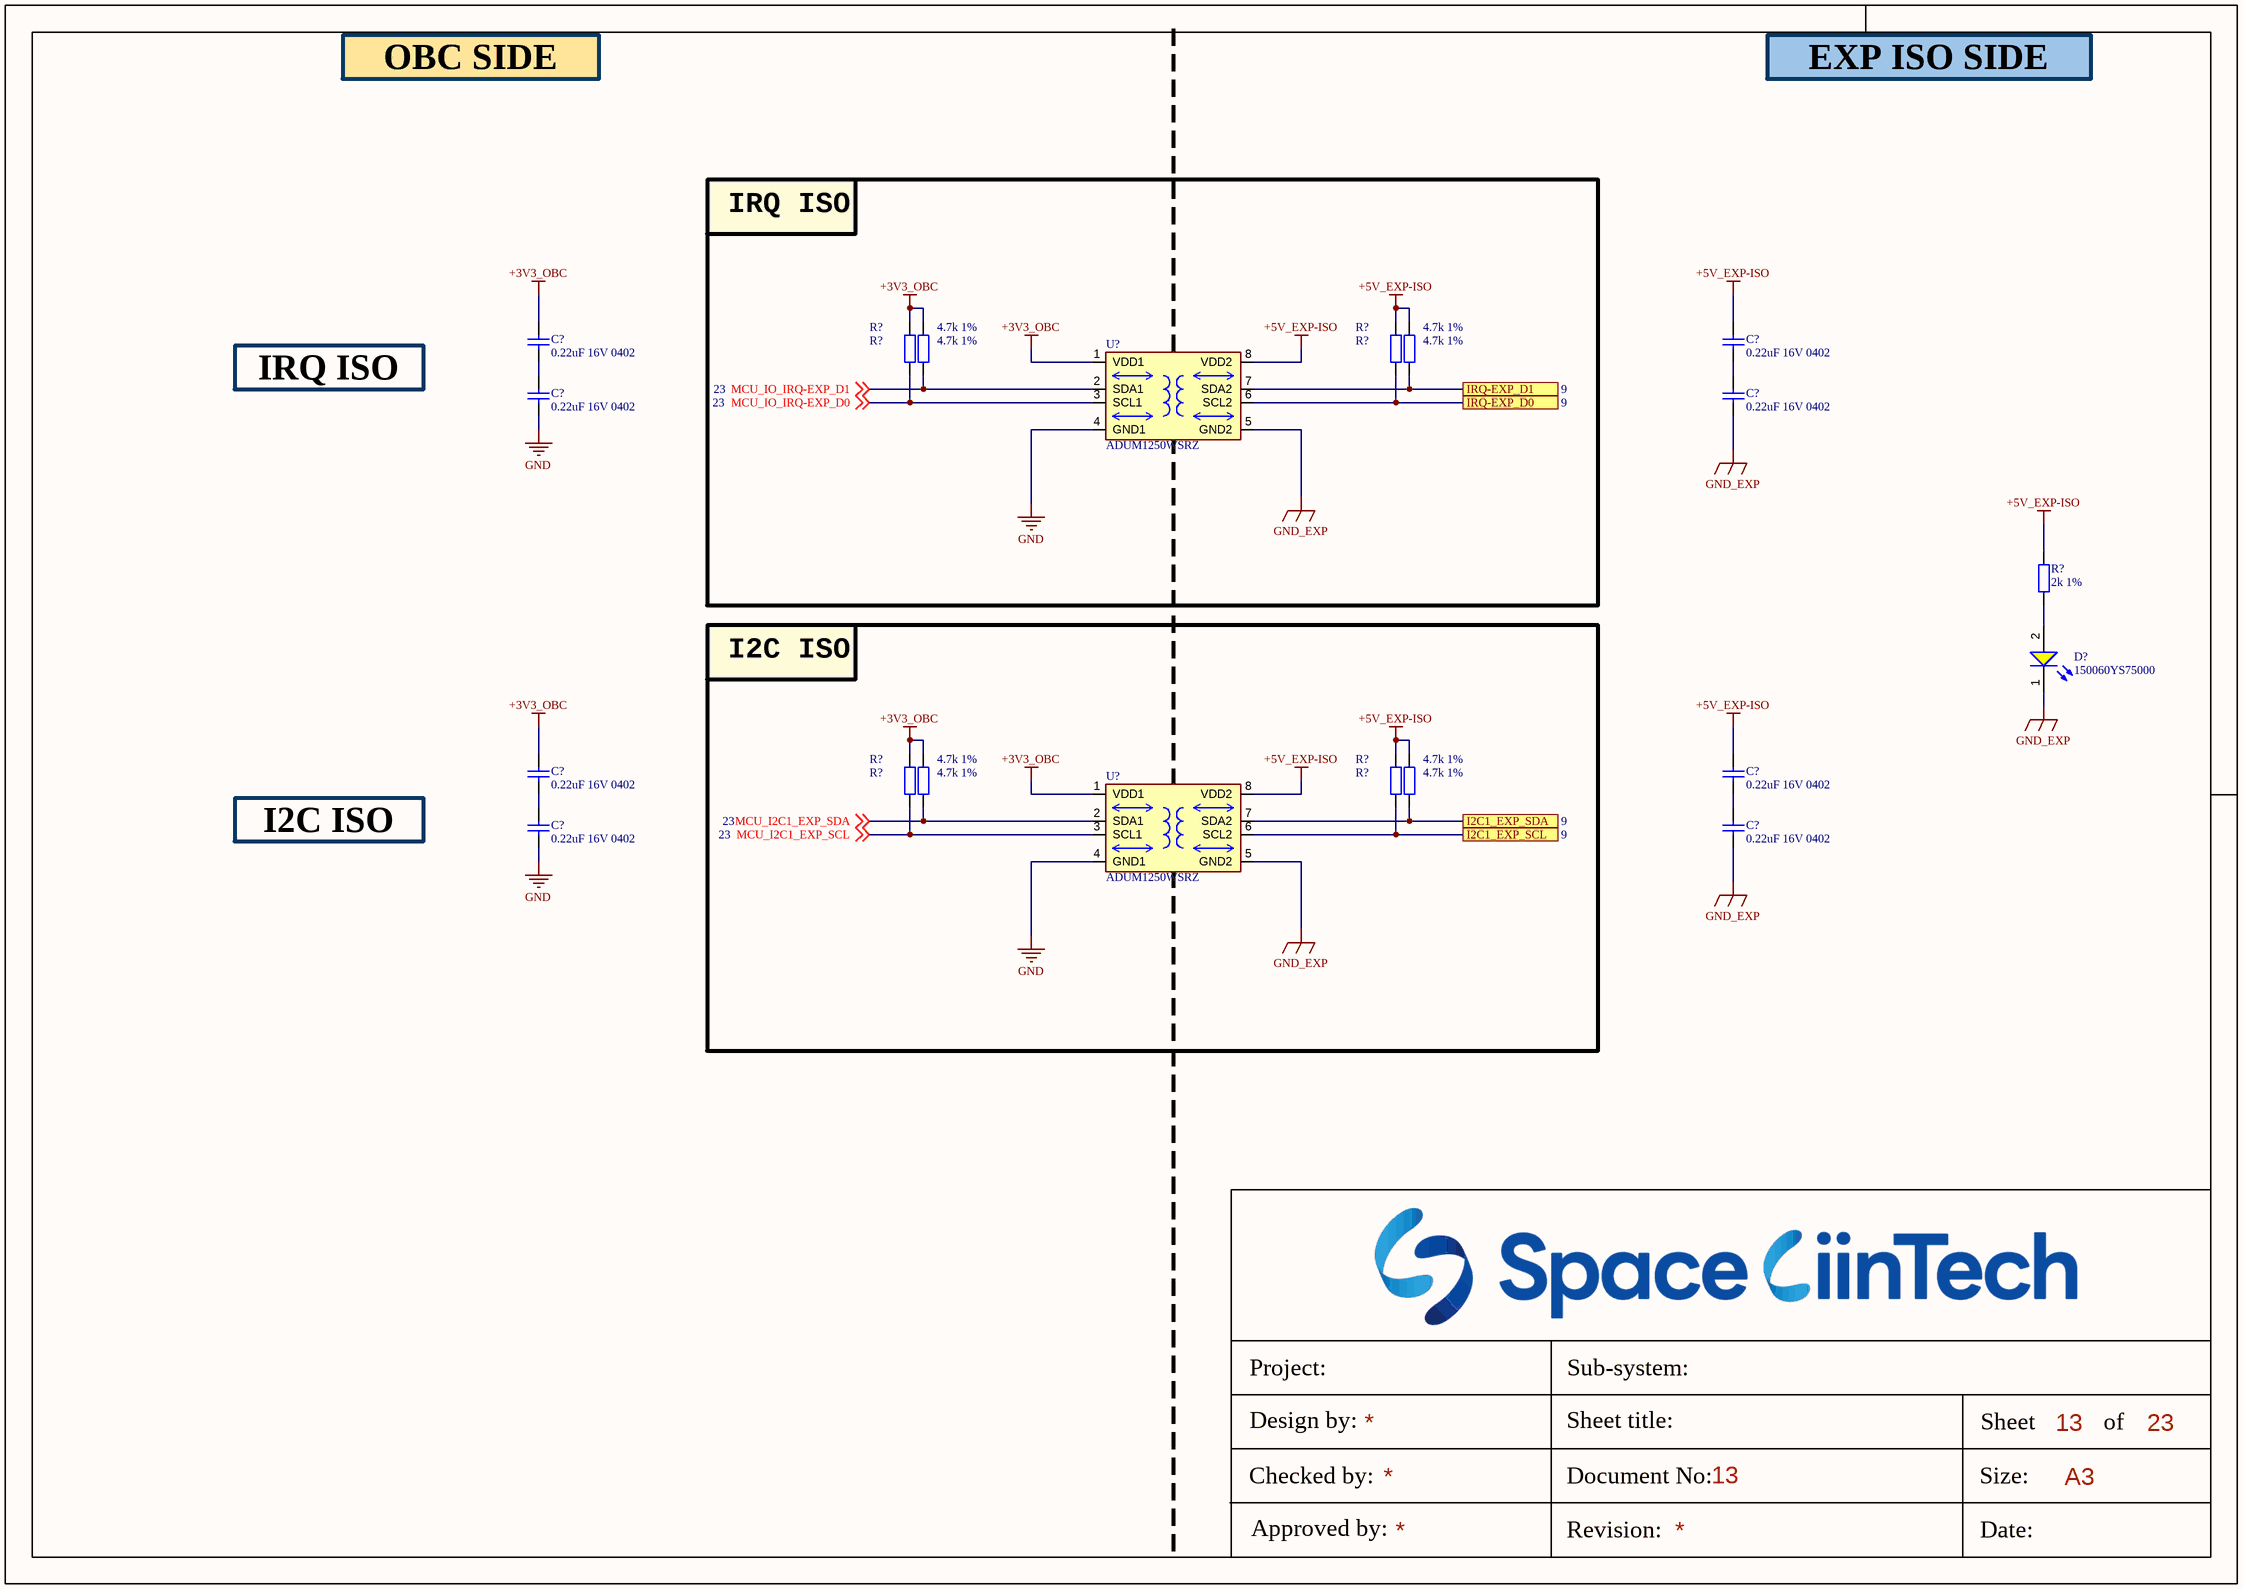
[diagram p12: obc-v2_EXP-I2C-IRQ.SchDoc]

### Parts
(Parts that share a designator on the sheet are numbered #1, #2 ... from top to bottom, then left to right.)
C?#96  0.22uF 16V 0402  [tu 0402]
C?#97  0.22uF 16V 0402  [tu 0402]
C?#98  0.22uF 16V 0402  [tu 0402]
C?#99  0.22uF 16V 0402  [tu 0402]
C?#100  0.22uF 16V 0402  [tu 0402]
C?#101  0.22uF 16V 0402  [tu 0402]
C?#102  0.22uF 16V 0402  [tu 0402]
C?#103  0.22uF 16V 0402  [tu 0402]
D?#9  150060YS75000  [WL-SMCW_0603_150060xx75000]
R?#38  4.7k 1%  [tro smd 0603]
R?#39  4.7k 1%  [tro smd 0603]
R?#40  4.7k 1%  [tro smd 0603]
R?#41  4.7k 1%  [tro smd 0603]
R?#42  2k 1%  [tro smd 0603]
R?#43  4.7k 1%  [tro smd 0603]
R?#44  4.7k 1%  [tro smd 0603]
R?#45  4.7k 1%  [tro smd 0603]
R?#46  4.7k 1%  [tro smd 0603]
U?#16  ADUM1250WSRZ  [SO8-COOL]
U?#17  ADUM1250WSRZ  [SO8-COOL]

### Blocks framed on the sheet
IRQ ISO: R?#38-R?#41 U?#16
I2C ISO: R?#43-R?#46 U?#17

### Ports
I2C1_EXP_SCL (see 9), I2C1_EXP_SDA (see 9), IRQ-EXP_D0 (see 9), IRQ-EXP_D1 (see 9)

### Nets
+3V3_OBC: C?#96.1 C?#100.1 R?#38.2 R?#39.2 R?#43.2 R?#44.2 U?#16.1(VDD1) U?#17.1(VDD1)
+5V_EXP-ISO: C?#97.1 C?#101.1 R?#40.2 R?#41.2 R?#42.2 R?#45.2 R?#46.2 U?#16.8(VDD2) U?#17.8(VDD2)
GND: C?#98.2 C?#102.2 U?#16.4(GND1) U?#17.4(GND1)
GND_EXP: C?#99.2 C?#103.2 D?#9.1(K) U?#16.5(GND2) U?#17.5(GND2)
MCU_I2C1_EXP_SCL: R?#43.1 U?#17.3(SCL1) ; off-sheet MCU_I2C1_EXP_SCL
MCU_I2C1_EXP_SDA: R?#44.1 U?#17.2(SDA1) ; off-sheet MCU_I2C1_EXP_SDA
MCU_IO_IRQ-EXP_D0: R?#38.1 U?#16.3(SCL1) ; off-sheet MCU_IO_IRQ-EXP_D0
MCU_IO_IRQ-EXP_D1: R?#39.1 U?#16.2(SDA1) ; off-sheet MCU_IO_IRQ-EXP_D1
NetC?#96_2: C?#96.2 C?#98.1
NetC?#97_2: C?#97.2 C?#99.1
NetC?#100_2: C?#100.2 C?#102.1
NetC?#101_2: C?#101.2 C?#103.1
NetD?#9_2: D?#9.2(A) R?#42.1
NetJ?#3_5: R?#45.1 U?#17.6(SCL2) ; port I2C1_EXP_SCL
NetJ?#3_8: R?#41.1 U?#16.7(SDA2) ; port IRQ-EXP_D1
NetJ?#3_26: R?#46.1 U?#17.7(SDA2) ; port I2C1_EXP_SDA
NetJ?#3_29: R?#40.1 U?#16.6(SCL2) ; port IRQ-EXP_D0

### Notes on the sheet
- OBC SIDE
- EXP ISO SIDE
- IRQ ISO
- I2C ISO
- Project:
- Sub-system:
- Design by:
- Sheet title:
- Sheet
- A3
- of
- Checked by:
- Approved by:
- Revision:
- Document No:
- Size:
- Date:

### Library data of the parts
C?#96-C?#103 = Tu 0402 33nF 10V: as C?#1 on sheet obc-v2_POWER; Kieu_Chan: *
D?#9 = CMP-1426-00005-2: as D?#1 on sheet obc-v2_POWER; Case Code (Imperial): 0603; Height: 700µm; REACH SVHC: Unknown; Dominant Wavelength: 590nm; Min Operating Temperature: -40°C; Color: Yellow; Width: 800µm; Mount: Surface Mount; Packaging: Tape and Reel; Max Operating Temperature: 85°C; RoHS: Compliant; Max Reverse Voltage (DC): 5V; Case Code (Metric): 1608; Length: 1.6mm; Case/Package: 0603
R?#38-R?#41 R?#43-R?#46 = Tro 0603 1% 10k: as R?#2 on sheet obc-v2_OUT-eMMC; Kieu_Chan: *
R?#42 = Tro 0603 1% 10k: as R?#1 on sheet obc-v2_POWER; Kieu_Chan: *
U?#16 U?#17 = ADUM1250: IÂ²C Digital Isolator 2500Vrms 2 Channel 1Mbps 25kV/Âµs CMTI 8-SOIC (0.154", 3.90mm Width); MF: Analog Devices; Package: SOIC-8; Price: None; Value: *; SnapEDA_Link: https://www.snapeda.com/parts/ADUM1250/Analog+Devices/view-part/?ref=snap; MP: ADUM1250; Availability: Unavailable; Check_prices: https://www.snapeda.com/parts/ADUM1250/Analog+Devices/view-part/?ref=eda